# Altium schematic sheet Driver.SchDoc
size 1249 x 800 mm; SheetNumber: 1; SheetTotal: 1
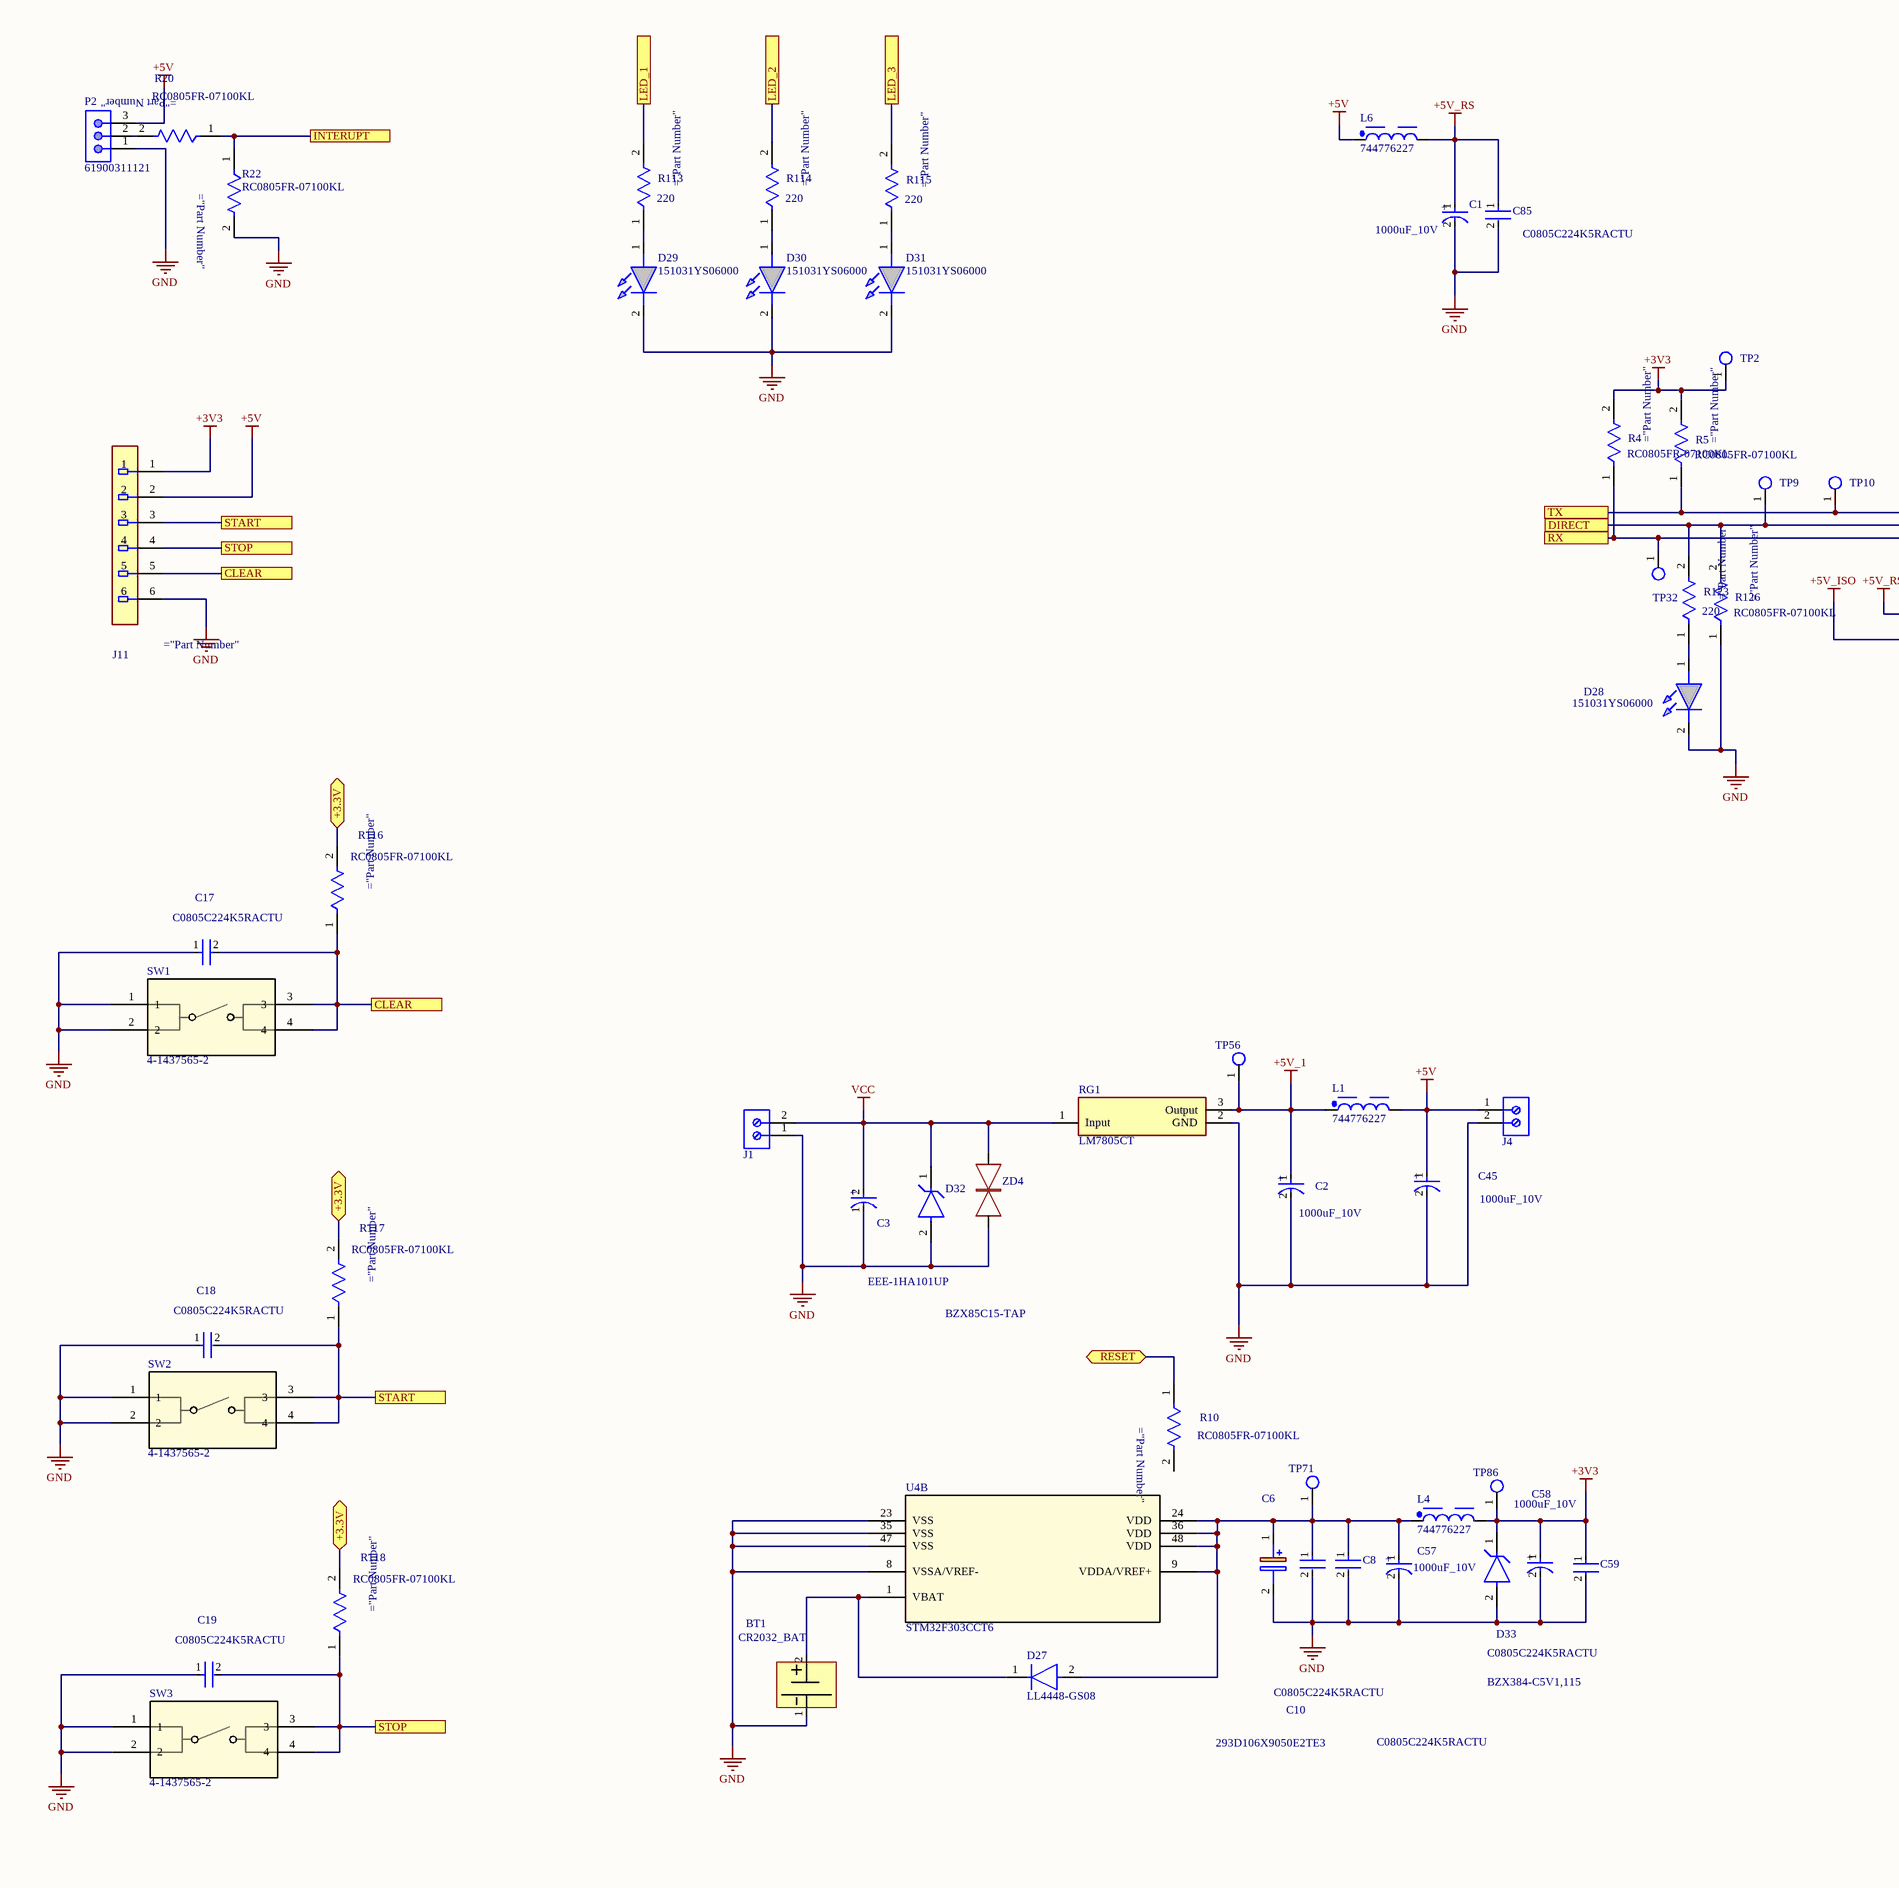
[diagram p0: Driver.SchDoc, top column 1 of 4]
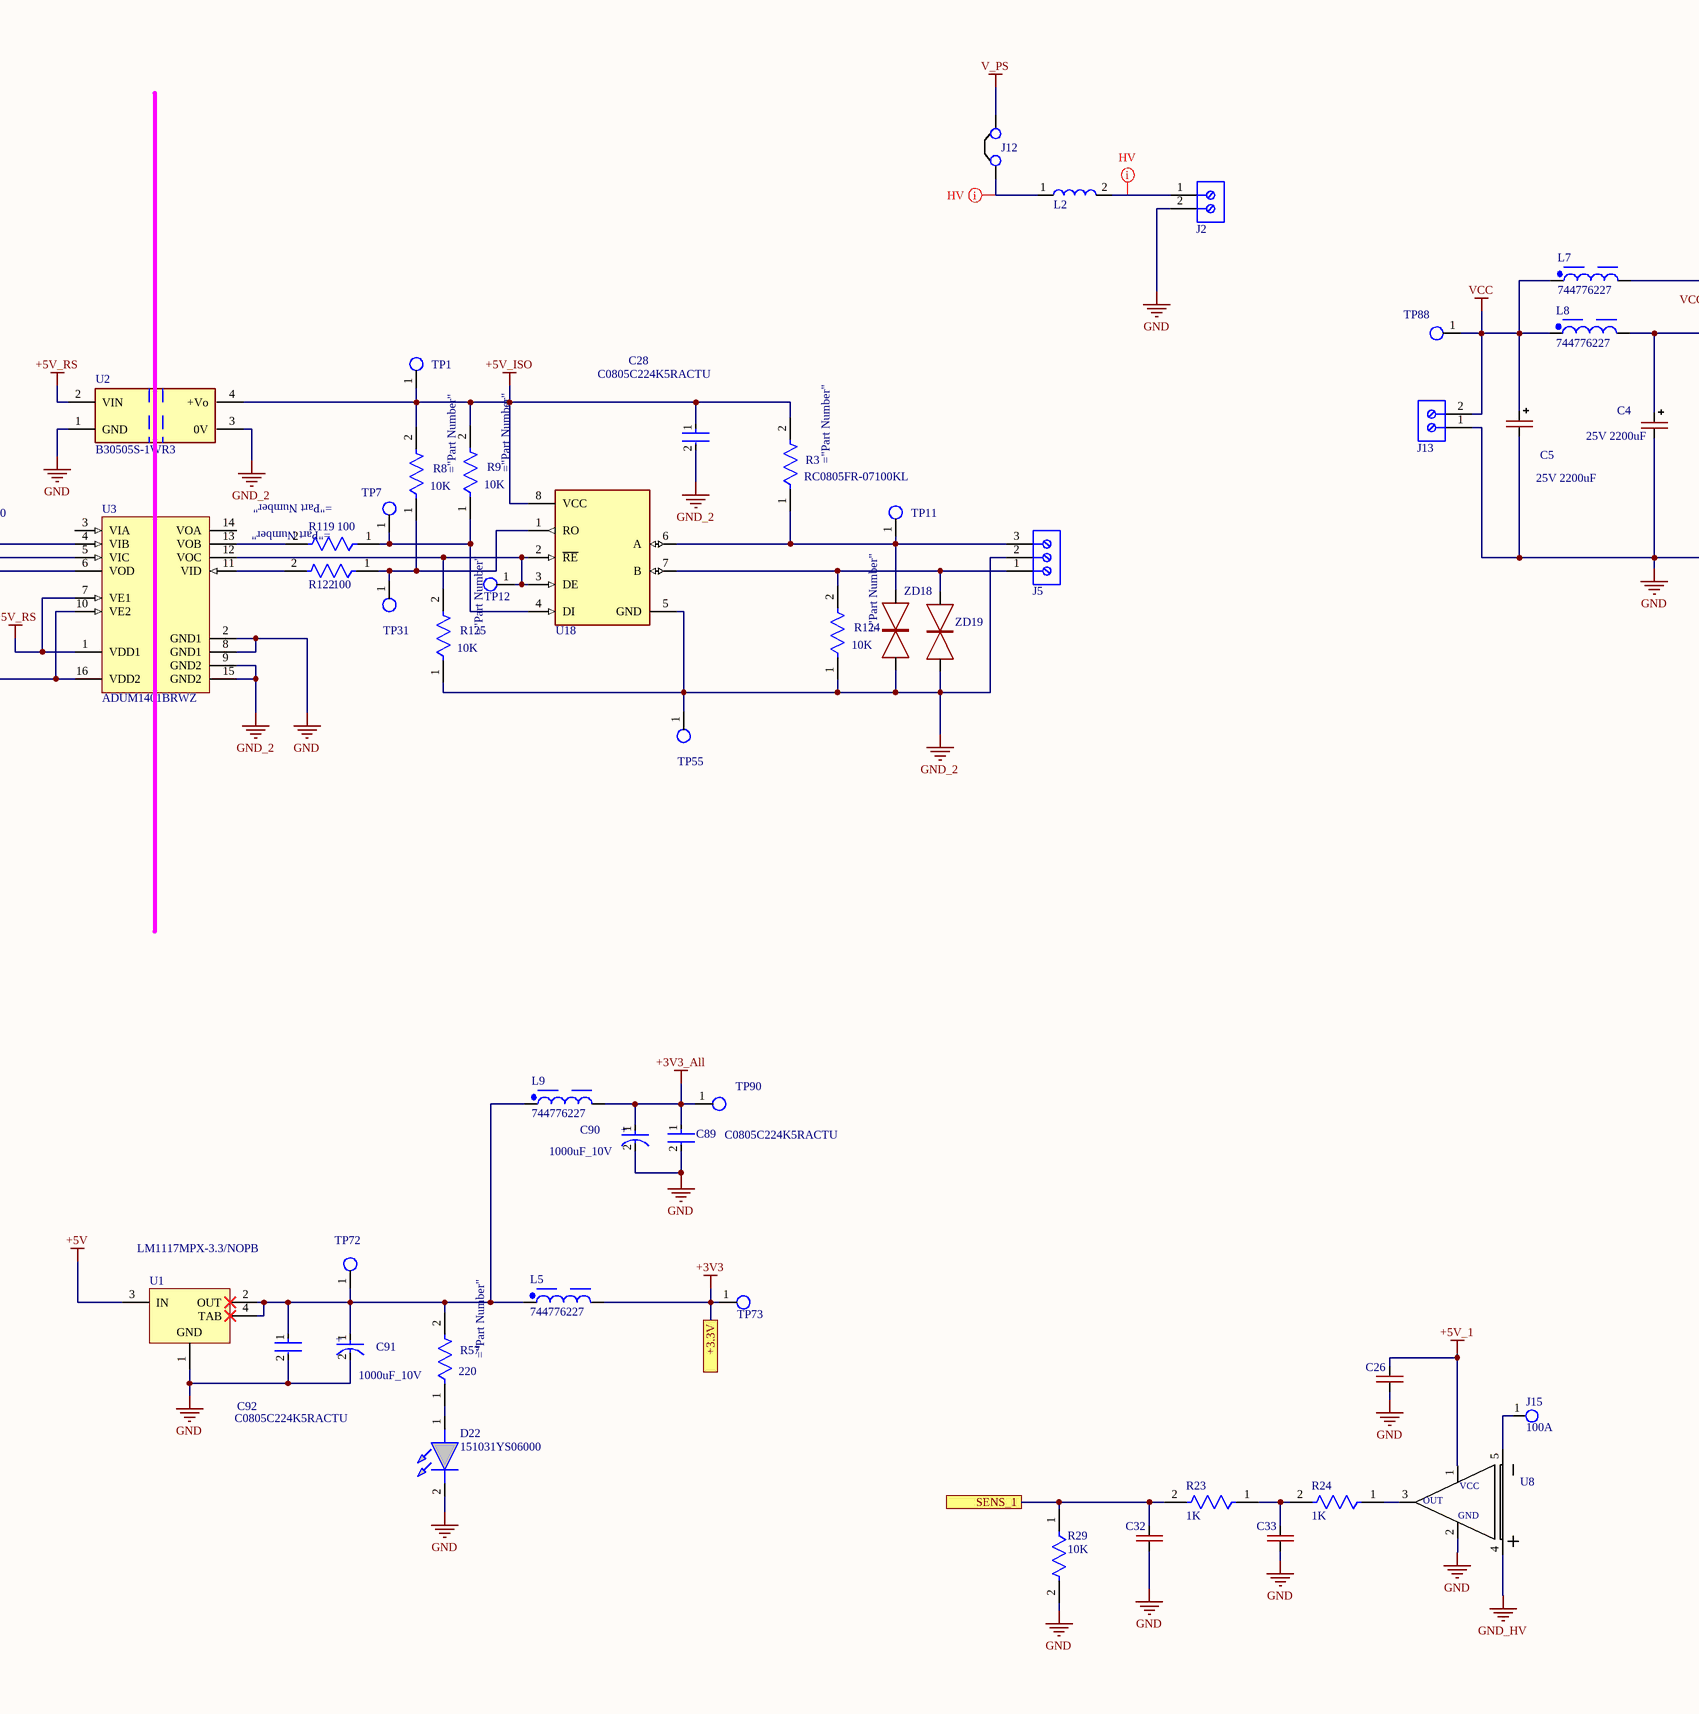
[diagram p1: Driver.SchDoc, top column 2 of 4]
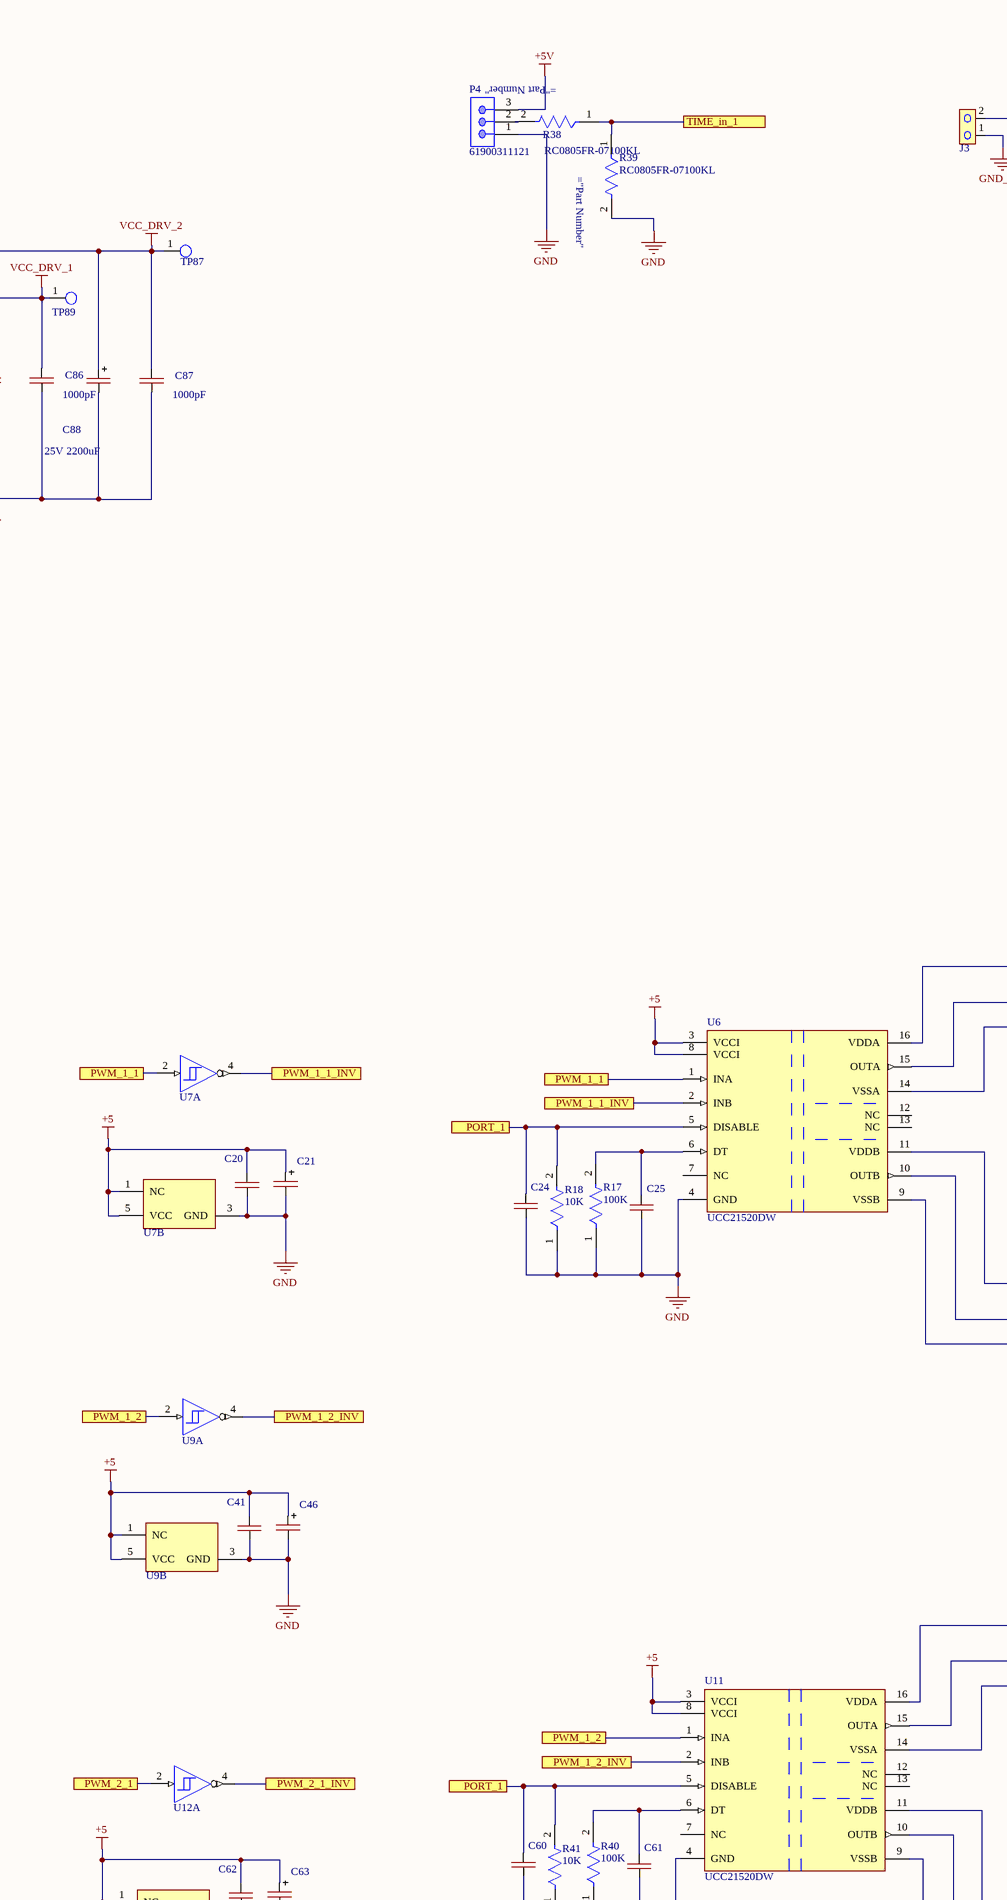
[diagram p2: Driver.SchDoc, top column 3 of 4]
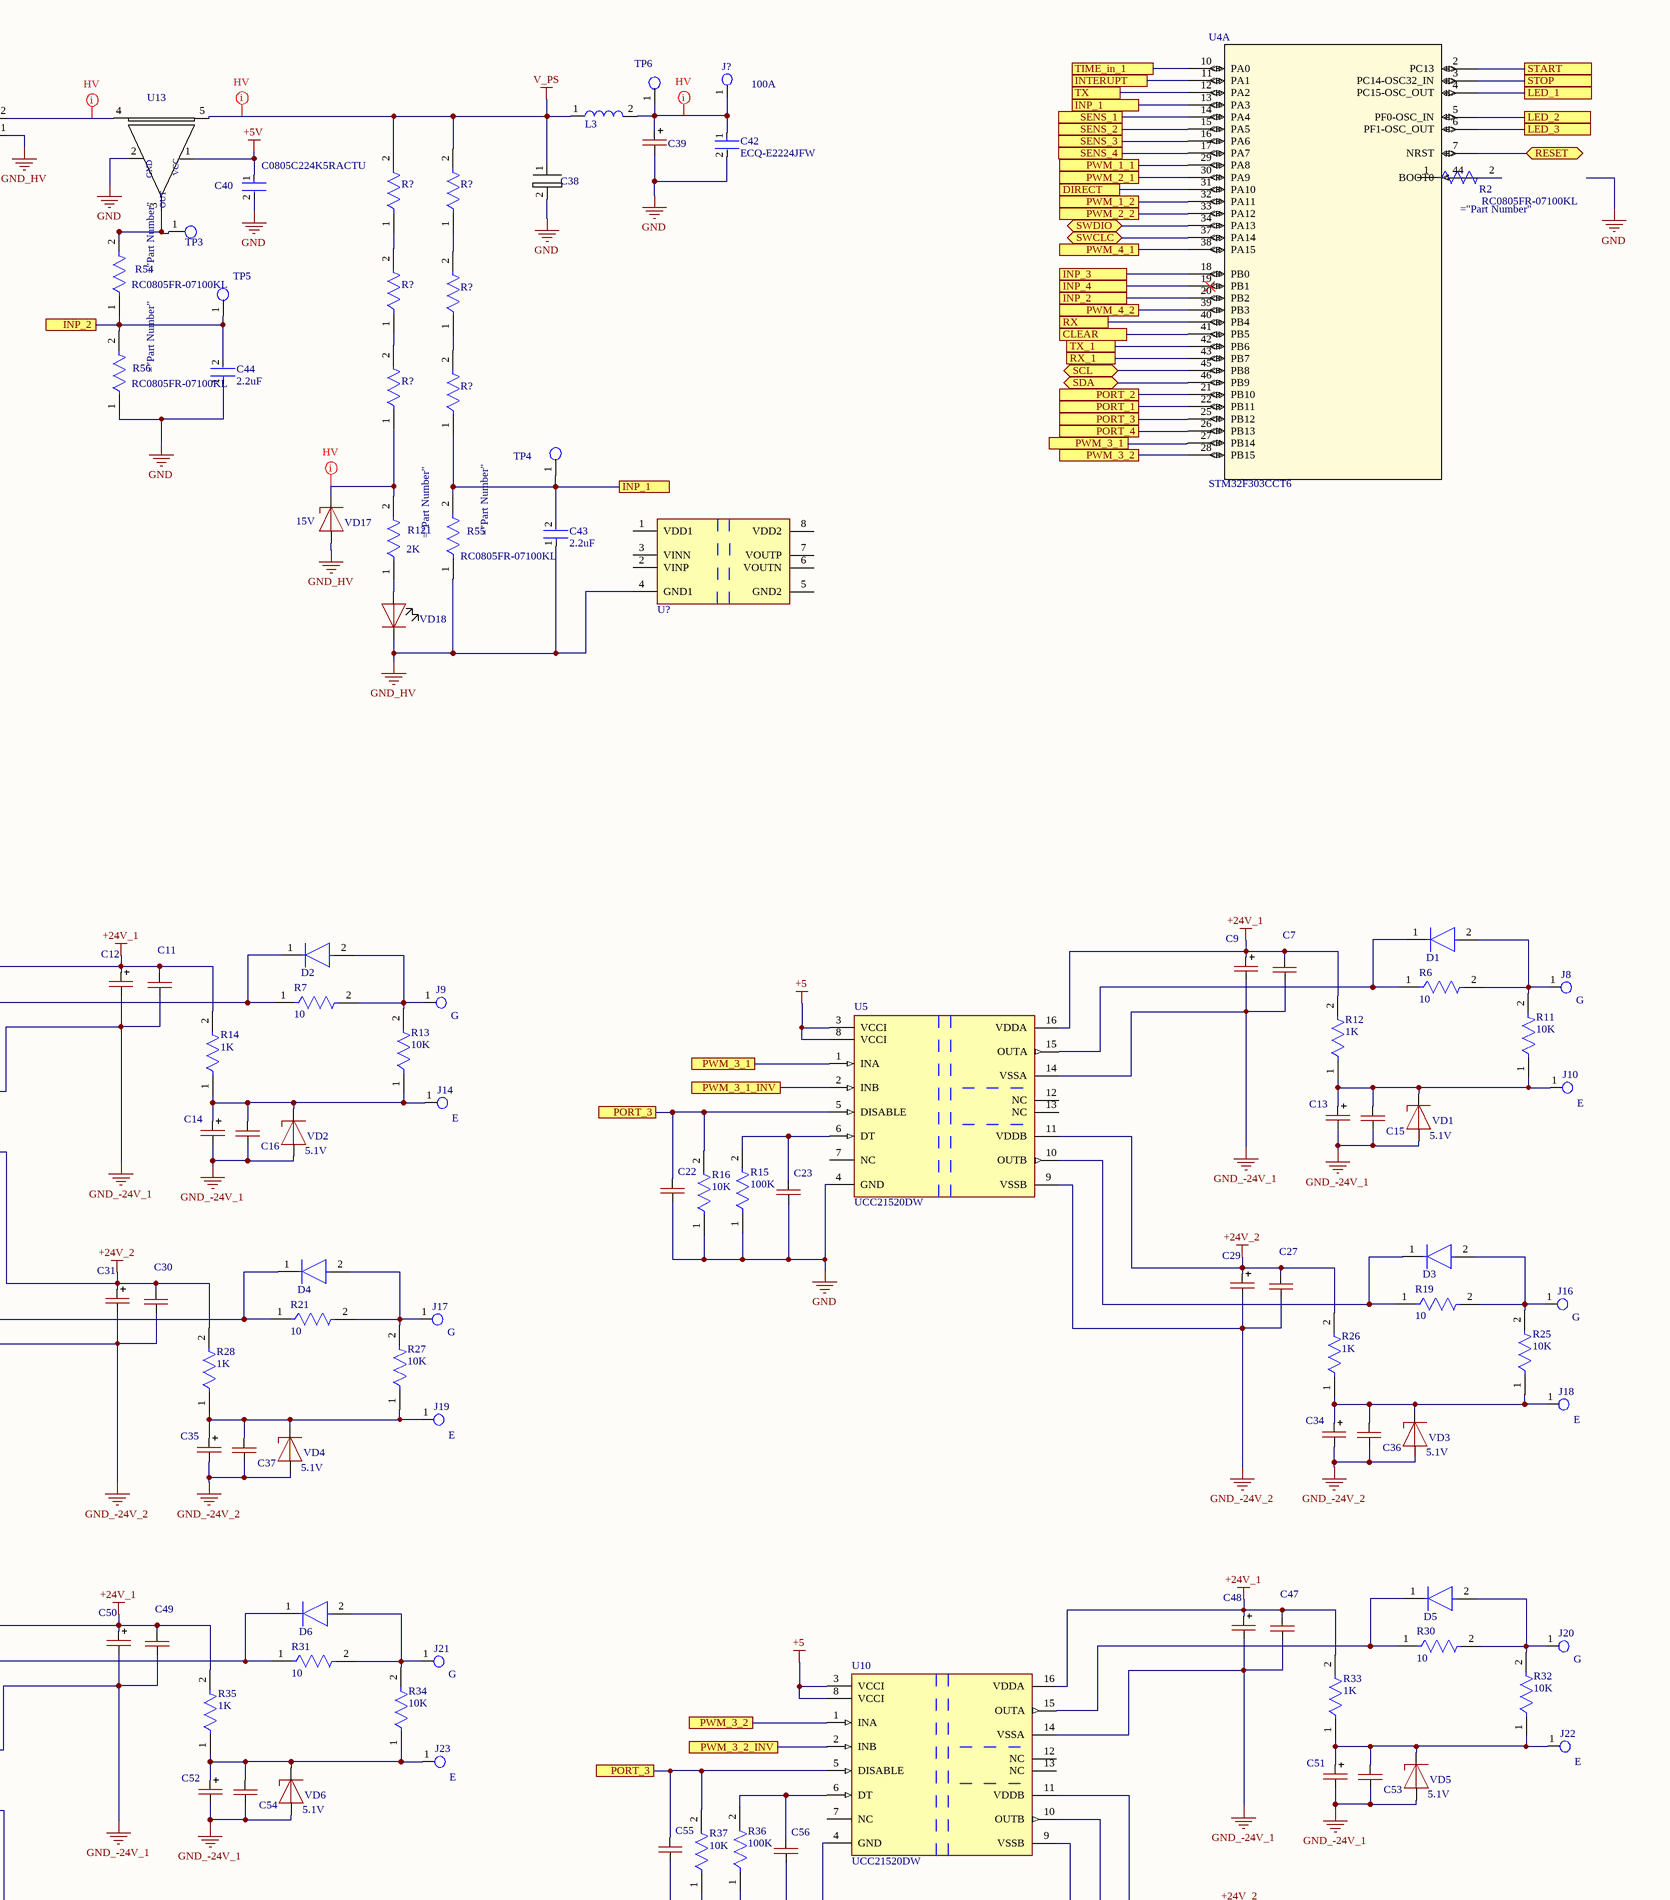
[diagram p3: Driver.SchDoc, top column 4 of 4]
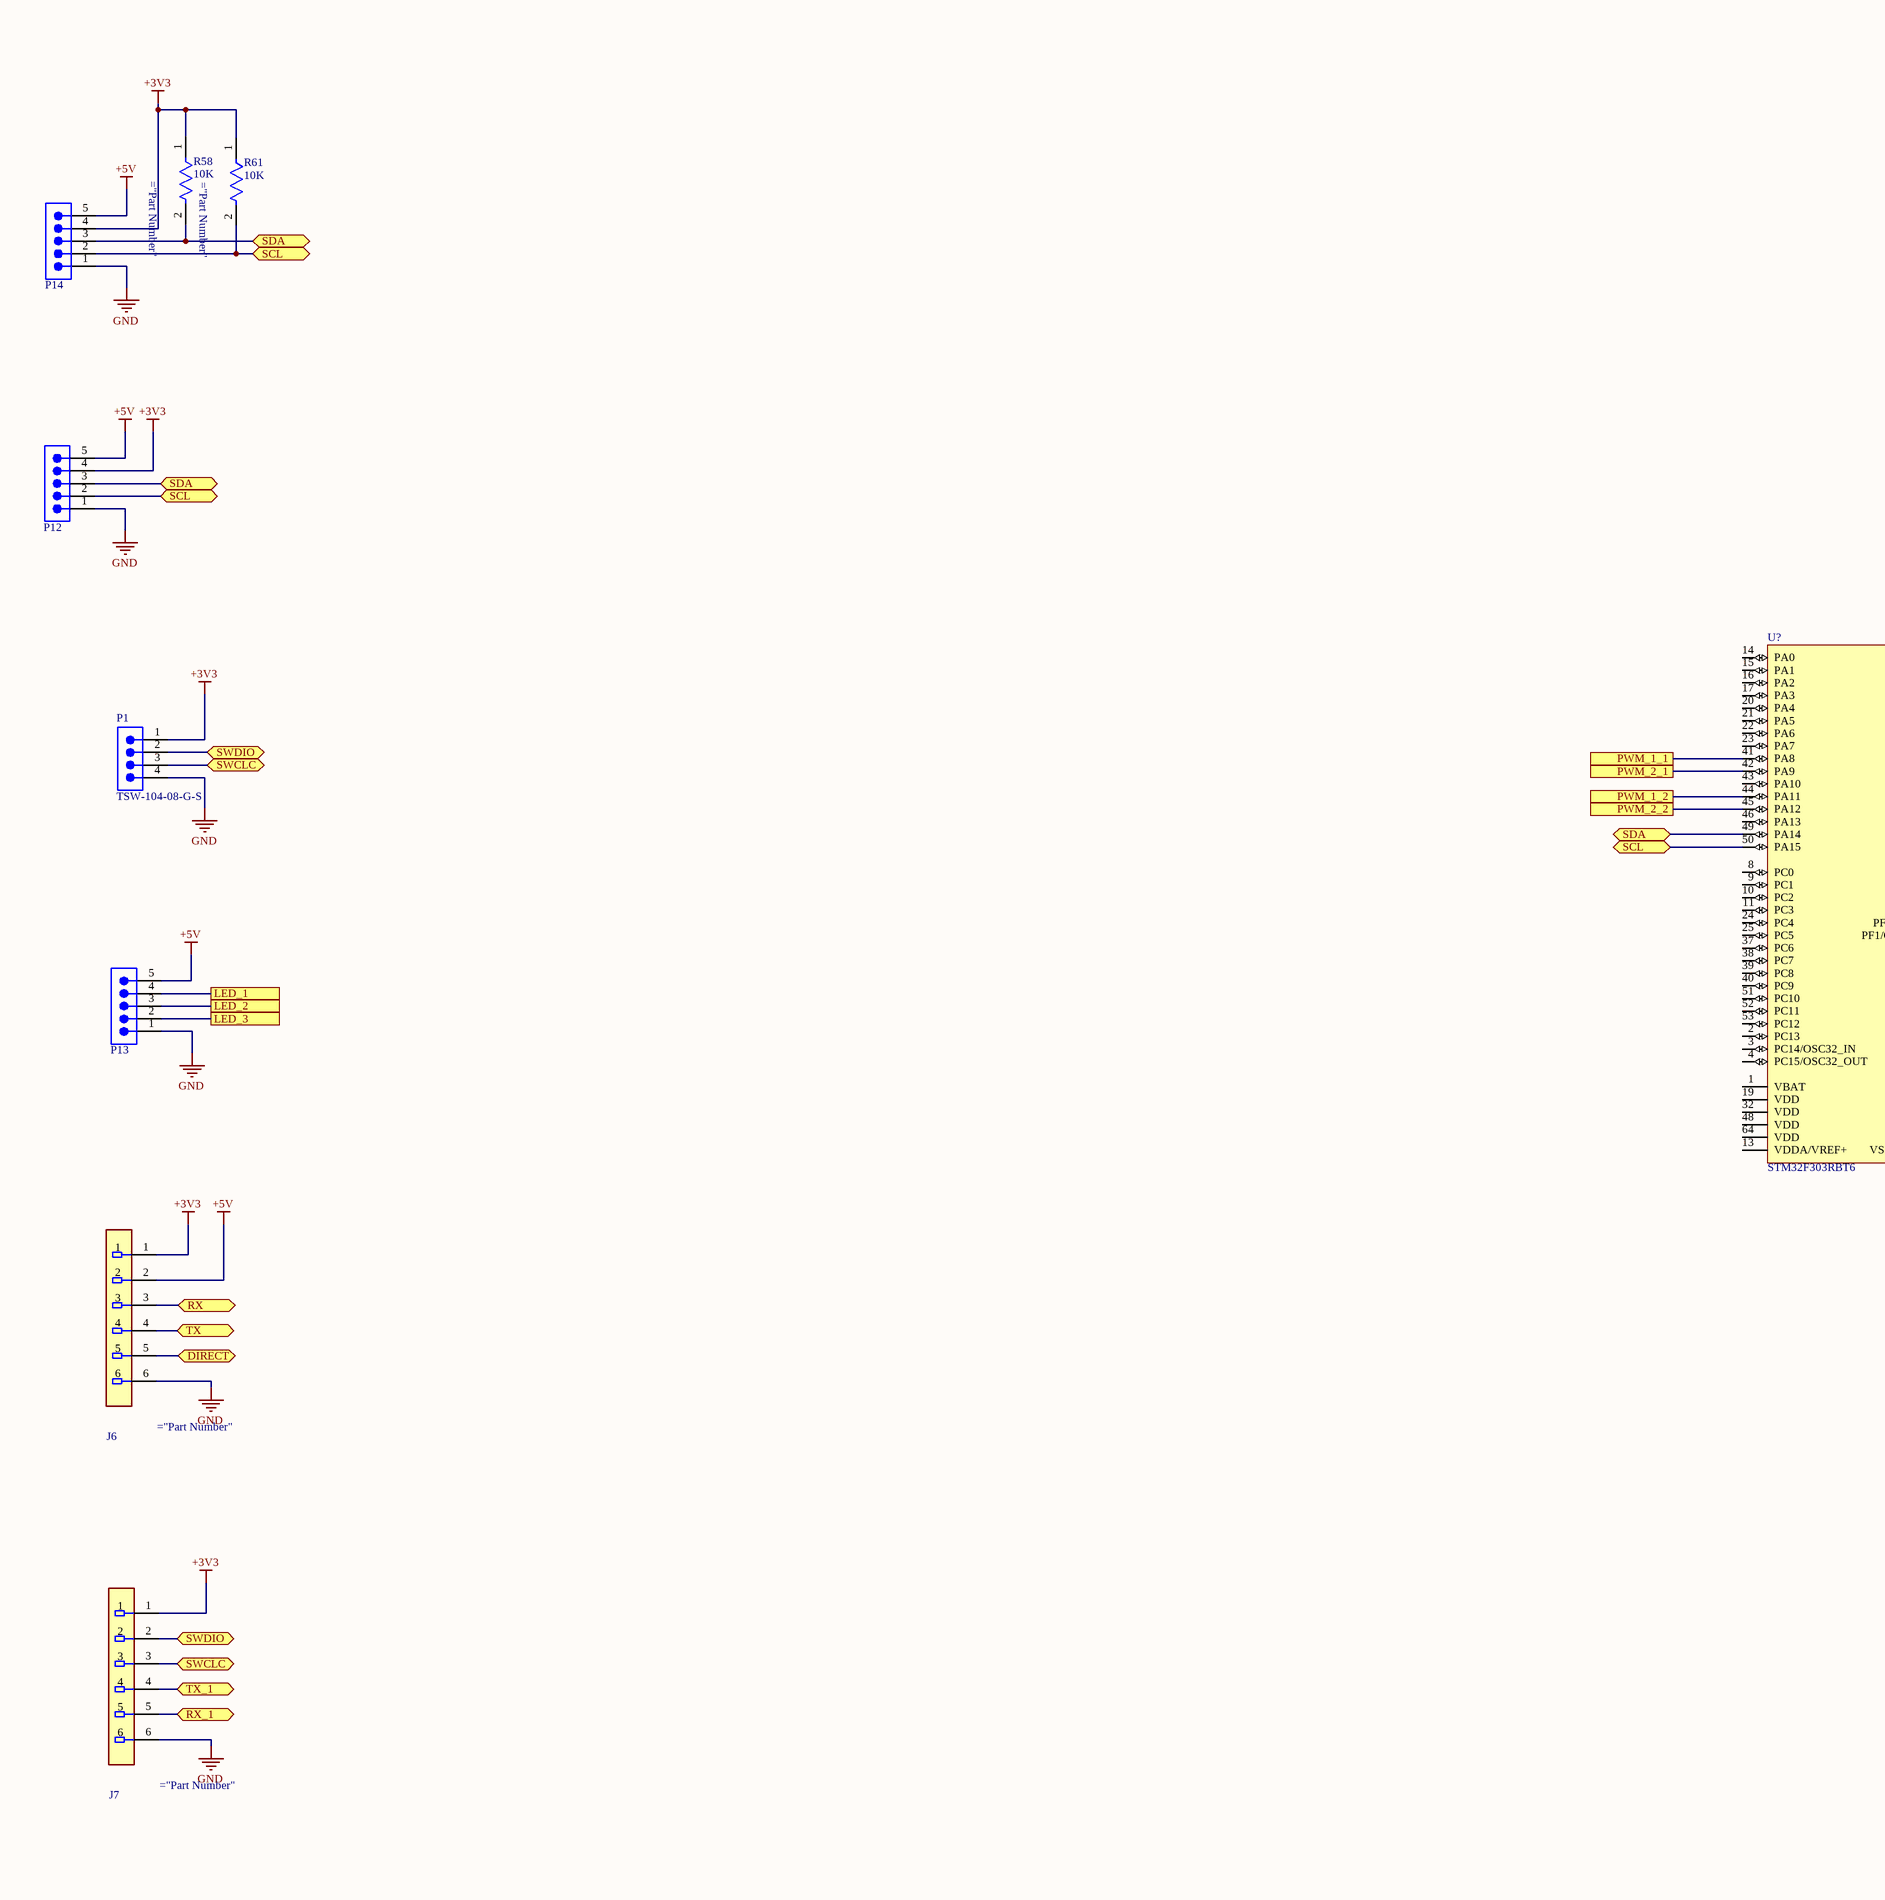
[diagram p4: Driver.SchDoc, bottom column 1 of 4]
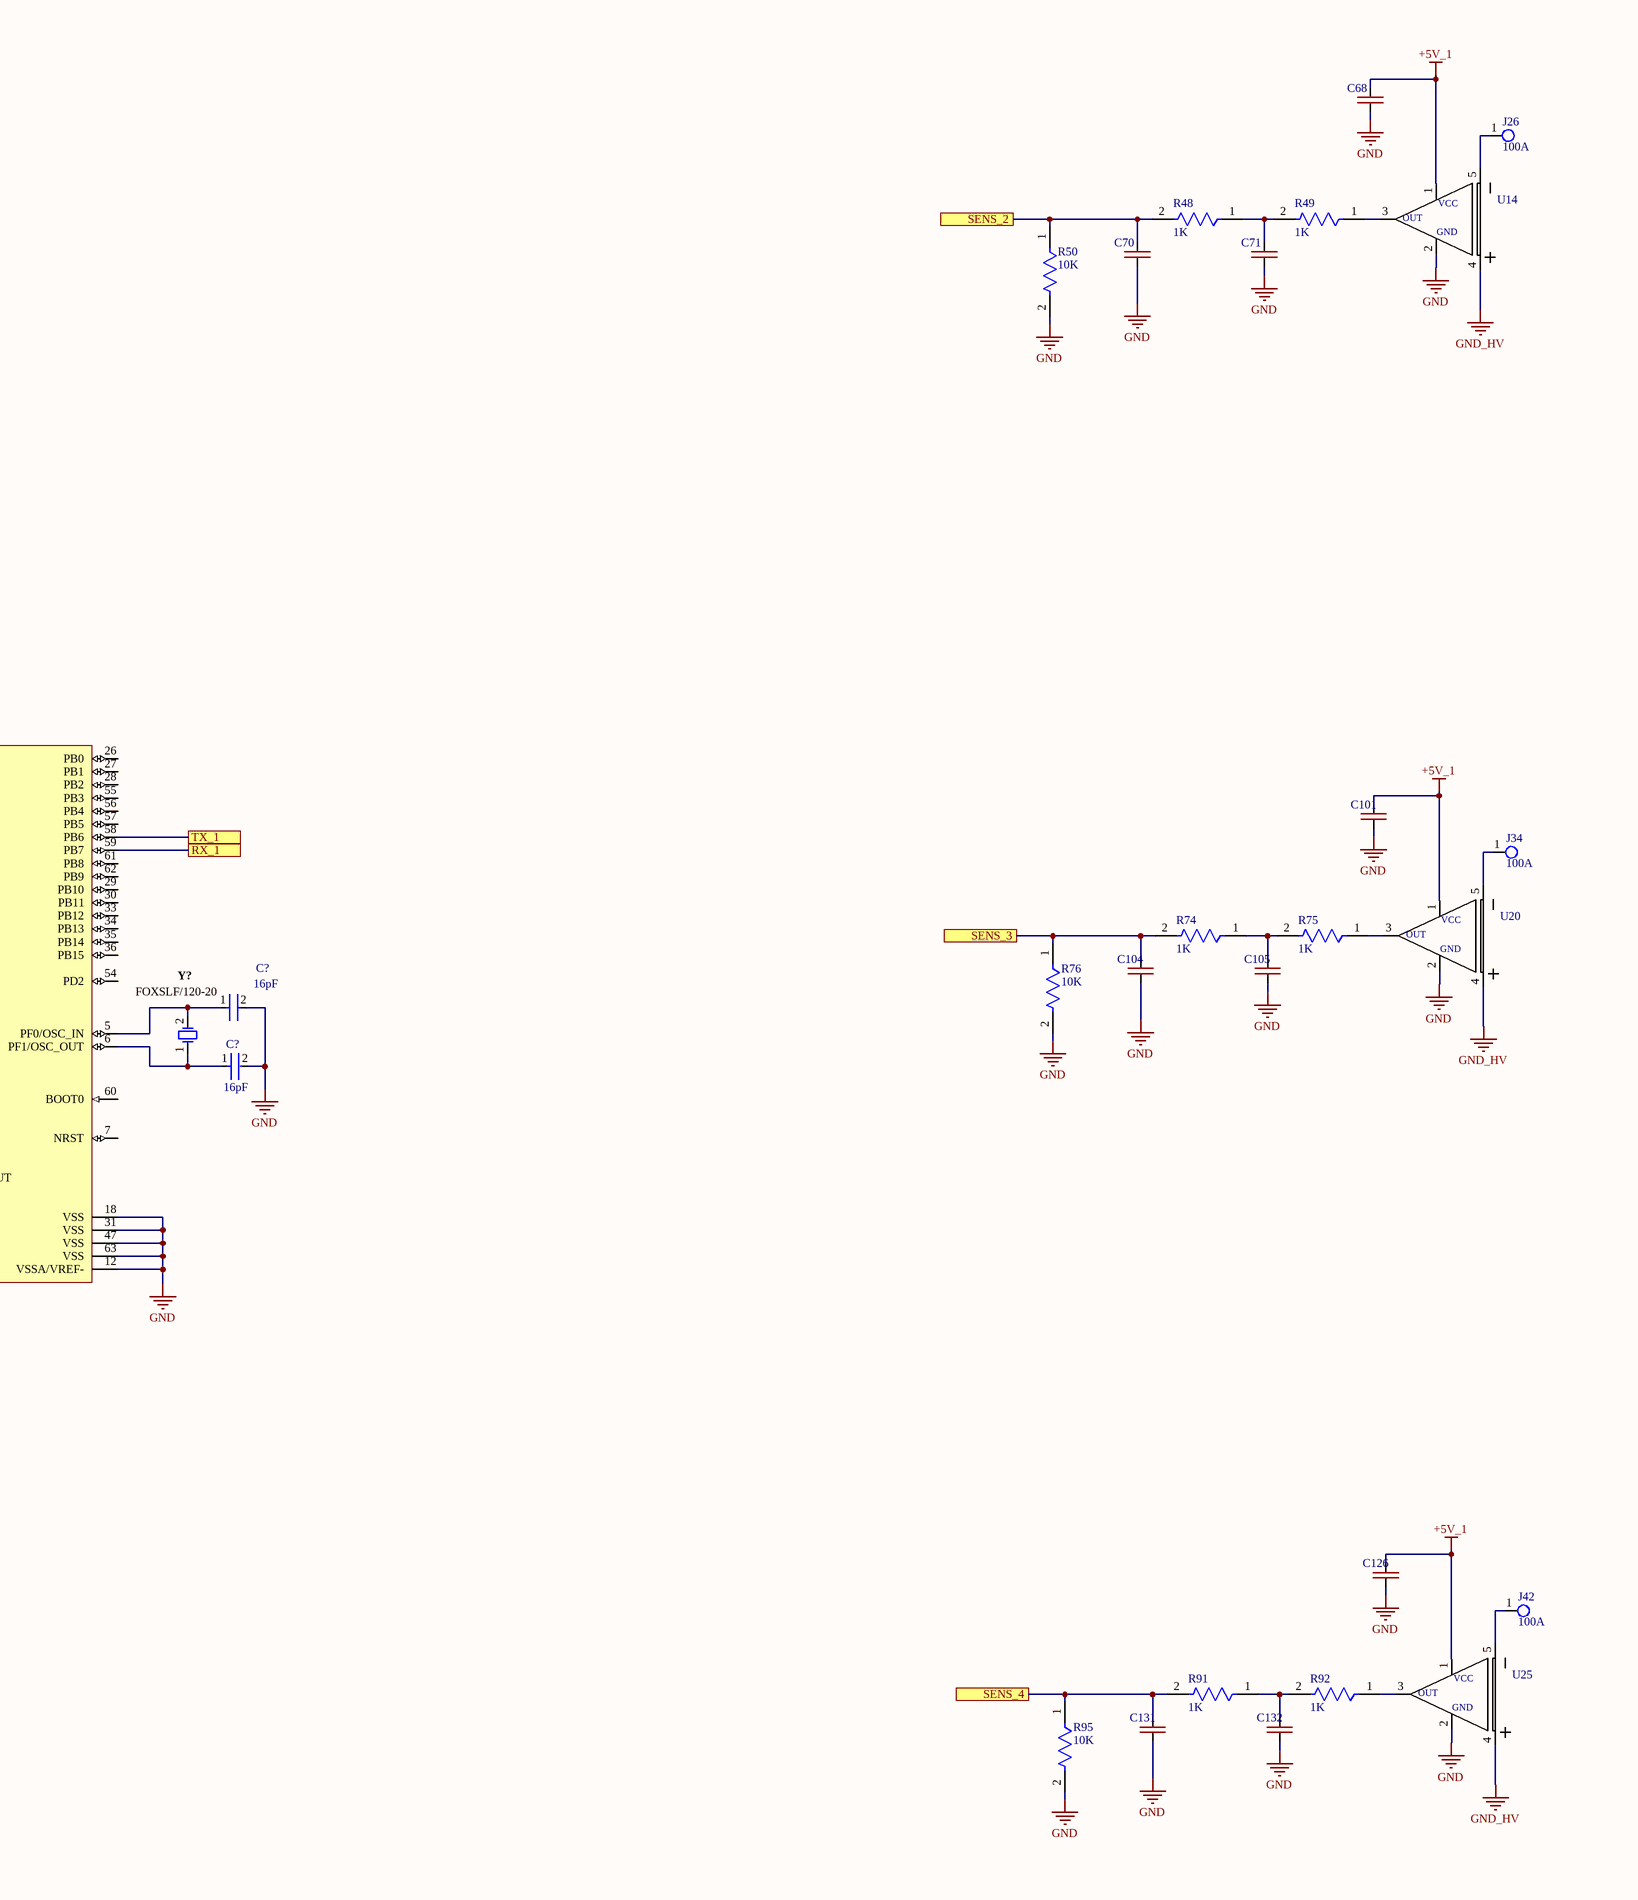
[diagram p5: Driver.SchDoc, bottom column 2 of 4]
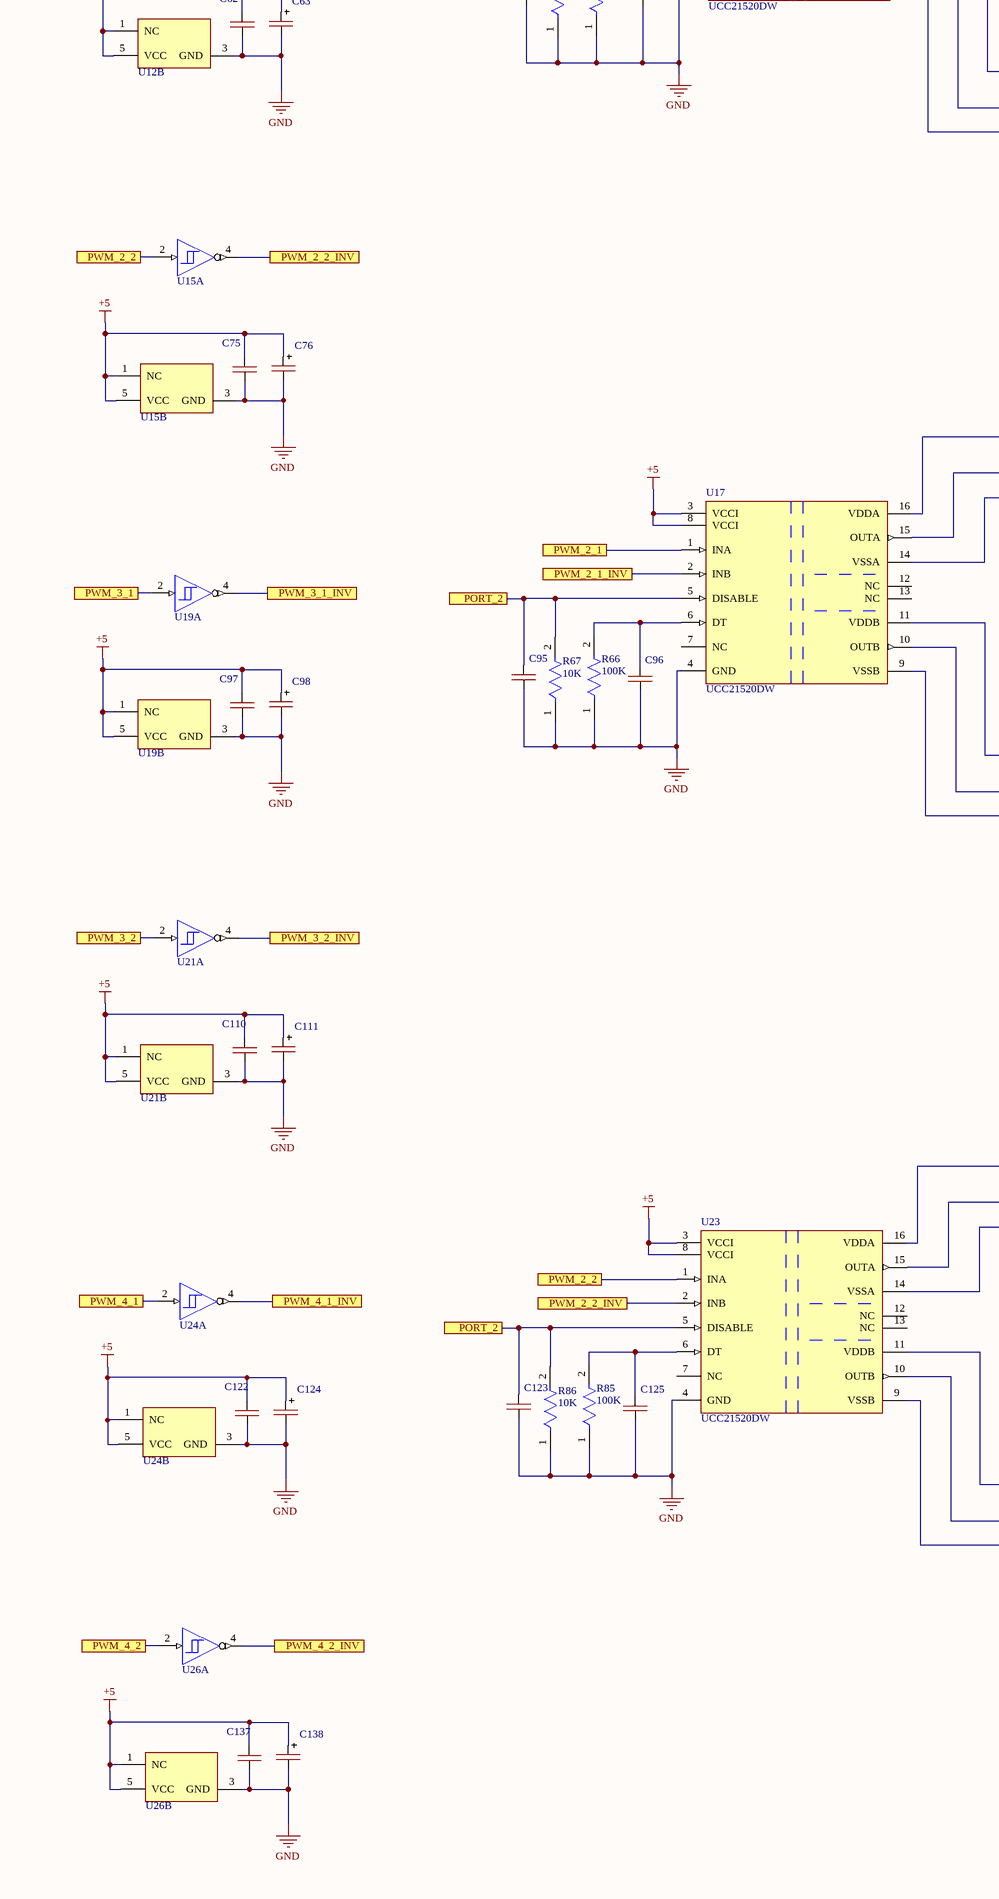
[diagram p6: Driver.SchDoc, bottom column 3 of 4]
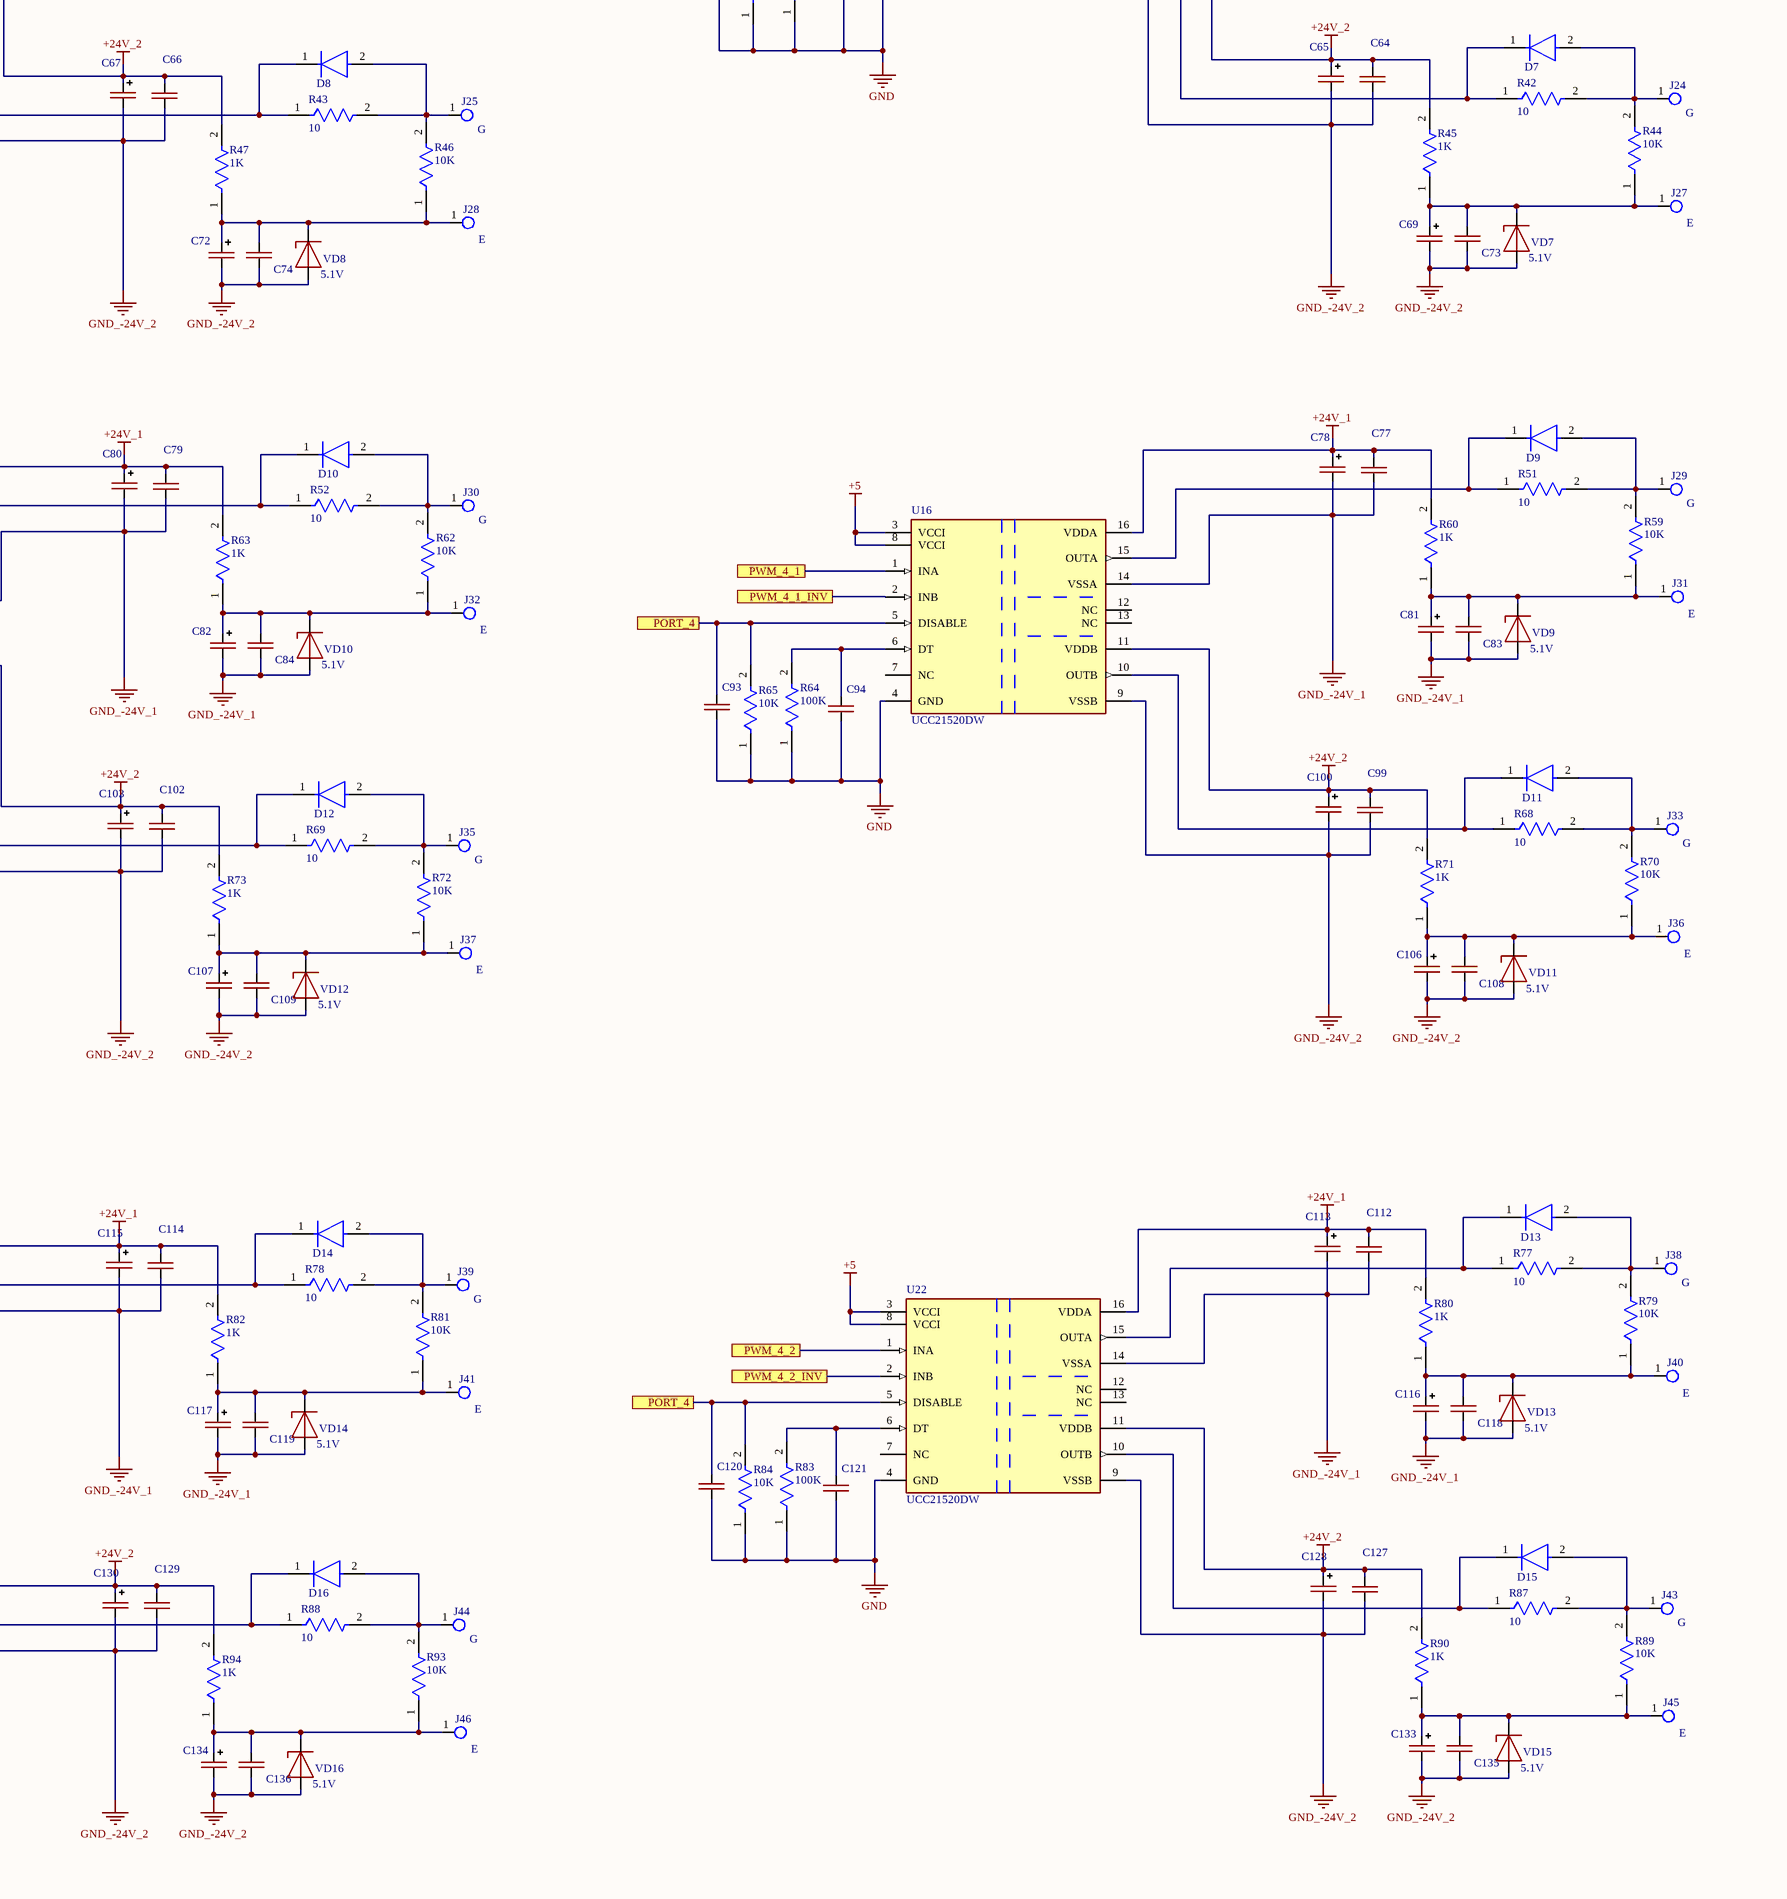
[diagram p7: Driver.SchDoc, bottom column 4 of 4]

## Parts
(Parts that share a designator on the sheet are numbered #1, #2 ... from top to bottom, then left to right.)
BT1  CR2032_BAT  [CR2032_BAT]
C1  1000uF_10V  [1000uF_10V_Size_F]
C2  1000uF_10V  [1000uF_10V_Size_F]
C3  EEE-1HA101UP  [FP-SF-MFG]
C4  25V 2200uF  [CAPPOL-12x25]
C5  25V 2200uF  [CAPPOL-12x25]
C6  293D106X9050E2TE3  [CAPPM7343X430N]
C7  CAP-NON-POLAR  [CAP-0805]  (value not drawn)
C8  C0805C224K5RACTU  [FP-C0805C-DN-MFG]
C9  CAP-POLAR  [CAPPOL-16x25]  (value not drawn)
C10  C0805C224K5RACTU  [FP-C0805C-DN-MFG]
C11  CAP-NON-POLAR  [CAP-0805]  (value not drawn)
C12  CAP-POLAR  [CAPPOL-16x25]  (value not drawn)
C13  CAP-POLAR  [CAP-TAN-D]  (value not drawn)
C14  CAP-POLAR  [CAP-TAN-D]  (value not drawn)
C15  CAP-NON-POLAR  [CAP-0805]  (value not drawn)
C16  CAP-NON-POLAR  [CAP-0805]  (value not drawn)
C17  C0805C224K5RACTU  [FP-C0805C-DN-IPC_A]
C18  C0805C224K5RACTU  [FP-C0805C-DN-IPC_A]
C19  C0805C224K5RACTU  [FP-C0805C-DN-IPC_A]
C20  CAP-NON-POLAR  [CAP-0805]  (value not drawn)
C21  CAP-POLAR  [CAP-TAN-D]  (value not drawn)
C22  CAP-NON-POLAR  [CAP-0805]  (value not drawn)
C23  CAP-NON-POLAR  [CAP-0805]  (value not drawn)
C24  CAP-NON-POLAR  [CAP-0805]  (value not drawn)
C25  CAP-NON-POLAR  [CAP-0805]  (value not drawn)
C26  CAP-NON-POLAR  [CAP-0805]  (value not drawn)
C27  CAP-NON-POLAR  [CAP-0805]  (value not drawn)
C28  C0805C224K5RACTU  [FP-C0805C-DN-MFG]
C29  CAP-POLAR  [CAPPOL-16x25]  (value not drawn)
C30  CAP-NON-POLAR  [CAP-0805]  (value not drawn)
C31  CAP-POLAR  [CAPPOL-16x25]  (value not drawn)
C32  CAP-NON-POLAR  [CAP-0805]  (value not drawn)
C33  CAP-NON-POLAR  [CAP-0805]  (value not drawn)
C34  CAP-POLAR  [CAP-TAN-D]  (value not drawn)
C35  CAP-POLAR  [CAP-TAN-D]  (value not drawn)
C36  CAP-NON-POLAR  [CAP-0805]  (value not drawn)
C37  CAP-NON-POLAR  [CAP-0805]  (value not drawn)
C38  450V_330uF  [CAP_450V_470uF]  (value not drawn)
C39  CAP-POLAR  [4700uF_100V]  (value not drawn)
C40  C0805C224K5RACTU  [FP-C0805C-DN-MFG]
C41  CAP-NON-POLAR  [CAP-0805]  (value not drawn)
C42  ECQ-E2224JFW  [FP-ECQ-E2224JFW-MFG]
C43  2.2uF  [FP-C0805C-DN-MFG]
C44  2.2uF  [FP-C0805C-DN-MFG]
C45  1000uF_10V  [1000uF_10V_Size_F]
C46  CAP-POLAR  [CAP-TAN-D]  (value not drawn)
C47  CAP-NON-POLAR  [CAP-0805]  (value not drawn)
C48  CAP-POLAR  [CAPPOL-16x25]  (value not drawn)
C49  CAP-NON-POLAR  [CAP-0805]  (value not drawn)
C50  CAP-POLAR  [CAPPOL-16x25]  (value not drawn)
C51  CAP-POLAR  [CAP-TAN-D]  (value not drawn)
C52  CAP-POLAR  [CAP-TAN-D]  (value not drawn)
C53  CAP-NON-POLAR  [CAP-0805]  (value not drawn)
C54  CAP-NON-POLAR  [CAP-0805]  (value not drawn)
C55  CAP-NON-POLAR  [CAP-0805]  (value not drawn)
C56  CAP-NON-POLAR  [CAP-0805]  (value not drawn)
C57  1000uF_10V  [1000uF_10V_Size_F]
C58  1000uF_10V  [1000uF_10V_Size_F]
C59  C0805C224K5RACTU  [FP-C0805C-DN-MFG]
C60  CAP-NON-POLAR  [CAP-0805]  (value not drawn)
C61  CAP-NON-POLAR  [CAP-0805]  (value not drawn)
C62  CAP-NON-POLAR  [CAP-0805]  (value not drawn)
C63  CAP-POLAR  [CAP-TAN-D]  (value not drawn)
C64  CAP-NON-POLAR  [CAP-0805]  (value not drawn)
C65  CAP-POLAR  [CAPPOL-16x25]  (value not drawn)
C66  CAP-NON-POLAR  [CAP-0805]  (value not drawn)
C67  CAP-POLAR  [CAPPOL-16x25]  (value not drawn)
C68  CAP-NON-POLAR  [CAP-0805]  (value not drawn)
C69  CAP-POLAR  [CAP-TAN-D]  (value not drawn)
C70  CAP-NON-POLAR  [CAP-0805]  (value not drawn)
C71  CAP-NON-POLAR  [CAP-0805]  (value not drawn)
C72  CAP-POLAR  [CAP-TAN-D]  (value not drawn)
C73  CAP-NON-POLAR  [CAP-0805]  (value not drawn)
C74  CAP-NON-POLAR  [CAP-0805]  (value not drawn)
C75  CAP-NON-POLAR  [CAP-0805]  (value not drawn)
C76  CAP-POLAR  [CAP-TAN-D]  (value not drawn)
C77  CAP-NON-POLAR  [CAP-0805]  (value not drawn)
C78  CAP-POLAR  [CAPPOL-16x25]  (value not drawn)
C79  CAP-NON-POLAR  [CAP-0805]  (value not drawn)
C80  CAP-POLAR  [CAPPOL-16x25]  (value not drawn)
C81  CAP-POLAR  [CAP-TAN-D]  (value not drawn)
C82  CAP-POLAR  [CAP-TAN-D]  (value not drawn)
C83  CAP-NON-POLAR  [CAP-0805]  (value not drawn)
C84  CAP-NON-POLAR  [CAP-0805]  (value not drawn)
C85  C0805C224K5RACTU  [FP-C0805C-DN-MFG]
C86  1000pF  [CAP-1206]
C87  1000pF  [CAP-1206]
C88  25V 2200uF  [CAPPOL-12x25]
C89  C0805C224K5RACTU  [FP-C0805C-DN-MFG]
C90  1000uF_10V  [1000uF_10V_Size_F]
C91  1000uF_10V  [1000uF_10V_Size_F]
C92  C0805C224K5RACTU  [FP-C0805C-DN-MFG]
C93  CAP-NON-POLAR  [CAP-0805]  (value not drawn)
C94  CAP-NON-POLAR  [CAP-0805]  (value not drawn)
C95  CAP-NON-POLAR  [CAP-0805]  (value not drawn)
C96  CAP-NON-POLAR  [CAP-0805]  (value not drawn)
C97  CAP-NON-POLAR  [CAP-0805]  (value not drawn)
C98  CAP-POLAR  [CAP-TAN-D]  (value not drawn)
C99  CAP-NON-POLAR  [CAP-0805]  (value not drawn)
C100  CAP-POLAR  [CAPPOL-16x25]  (value not drawn)
C101  CAP-NON-POLAR  [CAP-0805]  (value not drawn)
C102  CAP-NON-POLAR  [CAP-0805]  (value not drawn)
C103  CAP-POLAR  [CAPPOL-16x25]  (value not drawn)
C104  CAP-NON-POLAR  [CAP-0805]  (value not drawn)
C105  CAP-NON-POLAR  [CAP-0805]  (value not drawn)
C106  CAP-POLAR  [CAP-TAN-D]  (value not drawn)
C107  CAP-POLAR  [CAP-TAN-D]  (value not drawn)
C108  CAP-NON-POLAR  [CAP-0805]  (value not drawn)
C109  CAP-NON-POLAR  [CAP-0805]  (value not drawn)
C110  CAP-NON-POLAR  [CAP-0805]  (value not drawn)
C111  CAP-POLAR  [CAP-TAN-D]  (value not drawn)
C112  CAP-NON-POLAR  [CAP-0805]  (value not drawn)
C113  CAP-POLAR  [CAPPOL-16x25]  (value not drawn)
C114  CAP-NON-POLAR  [CAP-0805]  (value not drawn)
C115  CAP-POLAR  [CAPPOL-16x25]  (value not drawn)
C116  CAP-POLAR  [CAP-TAN-D]  (value not drawn)
C117  CAP-POLAR  [CAP-TAN-D]  (value not drawn)
C118  CAP-NON-POLAR  [CAP-0805]  (value not drawn)
C119  CAP-NON-POLAR  [CAP-0805]  (value not drawn)
C120  CAP-NON-POLAR  [CAP-0805]  (value not drawn)
C121  CAP-NON-POLAR  [CAP-0805]  (value not drawn)
C122  CAP-NON-POLAR  [CAP-0805]  (value not drawn)
C123  CAP-NON-POLAR  [CAP-0805]  (value not drawn)
C124  CAP-POLAR  [CAP-TAN-D]  (value not drawn)
C125  CAP-NON-POLAR  [CAP-0805]  (value not drawn)
C126  CAP-NON-POLAR  [CAP-0805]  (value not drawn)
C127  CAP-NON-POLAR  [CAP-0805]  (value not drawn)
C128  CAP-POLAR  [CAPPOL-16x25]  (value not drawn)
C129  CAP-NON-POLAR  [CAP-0805]  (value not drawn)
C130  CAP-POLAR  [CAPPOL-16x25]  (value not drawn)
C131  CAP-NON-POLAR  [CAP-0805]  (value not drawn)
C132  CAP-NON-POLAR  [CAP-0805]  (value not drawn)
C133  CAP-POLAR  [CAP-TAN-D]  (value not drawn)
C134  CAP-POLAR  [CAP-TAN-D]  (value not drawn)
C135  CAP-NON-POLAR  [CAP-0805]  (value not drawn)
C136  CAP-NON-POLAR  [CAP-0805]  (value not drawn)
C137  CAP-NON-POLAR  [CAP-0805]  (value not drawn)
C138  CAP-POLAR  [CAP-TAN-D]  (value not drawn)
C?#1  16pF  [FP-GRM21B-0_1-IPC_C]
C?#2  16pF  [FP-GRM21B-0_1-IPC_C]
D1  US1G  [US1G_SMA]  (value not drawn)
D2  US1G  [US1G_SMA]  (value not drawn)
D3  US1G  [US1G_SMA]  (value not drawn)
D4  US1G  [US1G_SMA]  (value not drawn)
D5  US1G  [US1G_SMA]  (value not drawn)
D6  US1G  [US1G_SMA]  (value not drawn)
D7  US1G  [US1G_SMA]  (value not drawn)
D8  US1G  [US1G_SMA]  (value not drawn)
D9  US1G  [US1G_SMA]  (value not drawn)
D10  US1G  [US1G_SMA]  (value not drawn)
D11  US1G  [US1G_SMA]  (value not drawn)
D12  US1G  [US1G_SMA]  (value not drawn)
D13  US1G  [US1G_SMA]  (value not drawn)
D14  US1G  [US1G_SMA]  (value not drawn)
D15  US1G  [US1G_SMA]  (value not drawn)
D16  US1G  [US1G_SMA]  (value not drawn)
D22  151031YS06000  [LED_Yellow]
D27  LL4448-GS08  [FP-6_560-5005_01-4-MFG]
D28  151031YS06000  [LED_BLUE]
D29  151031YS06000  [Wurth_Electronics_0_MFG]
D30  151031YS06000  [LED_GREEN]
D31  151031YS06000  [LED_BLUE]
D32  BZX85C15-TAP  [FP-6_561-5001_02-4-MFG]
D33  BZX384-C5V1,115  [FP-SOD323-MFG]
J1  691101710002  [691101710002]  (value not drawn)
J2  691101710002  [691101710002]  (value not drawn)
J3  TL-800  [Conn_Tianli_T-800]  (value not drawn)
J4  691101710002  [691101710002]  (value not drawn)
J5  691101710003  [691101710003]  (value not drawn)
J6  SWR25X-NRTC-S06-ST-BA  [Sullins_SWR25X-NRTC-S06-ST-BA_MFG]  (value not drawn)
J7  SWR25X-NRTC-S06-ST-BA  [Sullins_SWR25X-NRTC-S06-ST-BA_MFG]  (value not drawn)
J8  G  [Klema_PCB_15A]
J9  G  [Klema_PCB_15A]
J10  E  [Klema_PCB_15A]
J11  SWR25X-NRTC-S06-ST-BA  [Sullins_SWR25X-NRTC-S06-ST-BA_MFG]  (value not drawn)
J12  Jumper 1x2.54  [Jumper_2.54]  (value not drawn)
J13  691101710002  [691101710002]  (value not drawn)
J14  E  [Klema_PCB_15A]
J15  100A  [Klema_100A]
J16  G  [Klema_PCB_15A]
J17  G  [Klema_PCB_15A]
J18  E  [Klema_PCB_15A]
J19  E  [Klema_PCB_15A]
J20  G  [Klema_PCB_15A]
J21  G  [Klema_PCB_15A]
J22  E  [Klema_PCB_15A]
J23  E  [Klema_PCB_15A]
J24  G  [Klema_PCB_15A]
J25  G  [Klema_PCB_15A]
J26  100A  [Klema_100A]
J27  E  [Klema_PCB_15A]
J28  E  [Klema_PCB_15A]
J29  G  [Klema_PCB_15A]
J30  G  [Klema_PCB_15A]
J31  E  [Klema_PCB_15A]
J32  E  [Klema_PCB_15A]
J33  G  [Klema_PCB_15A]
J34  100A  [Klema_100A]
J35  G  [Klema_PCB_15A]
J36  E  [Klema_PCB_15A]
J37  E  [Klema_PCB_15A]
J38  G  [Klema_PCB_15A]
J39  G  [Klema_PCB_15A]
J40  E  [Klema_PCB_15A]
J41  E  [Klema_PCB_15A]
J42  100A  [Klema_100A]
J43  G  [Klema_PCB_15A]
J44  G  [Klema_PCB_15A]
J45  E  [Klema_PCB_15A]
J46  E  [Klema_PCB_15A]
J?  100A  [Klema_100A]
L1  744776227  [WE-PD2_1054]
L2  Coil  [Coil_drosel]  (value not drawn)
L3  Coil  [Coil_drosel]  (value not drawn)
L4  744776227  [WE-PD2_1054]
L5  744776227  [WE-PD2_1054]
L6  744776227  [WE-PD2_1054]
L7  744776227  [WE-PD2_1054]
L8  744776227  [WE-PD2_1054]
L9  744776227  [WE-PD2_1054]
P1  TSW-104-08-G-S  [SMTC-TSW-104-08-X-S]
P2  61900311121  [61900311121]
P4  61900311121  [61900311121]
P12  61300511121  [61300511121]  (value not drawn)
P13  61300511121  [61300511121]  (value not drawn)
P14  61300511121  [61300511121]  (value not drawn)
R2  RC0805FR-07100KL  [Yageo_RC0805_IPC_A]
R3  RC0805FR-07100KL  [Yageo_RC0805_IPC_A]
R4  RC0805FR-07100KL  [Yageo_RC0805_IPC_A]
R5  RC0805FR-07100KL  [Yageo_RC0805_IPC_A]
R6  10  [RES-2512]
R7  10  [RES-2512]
R8  10K  [Yageo_RC0805_IPC_A]
R9  10K  [Yageo_RC0805_IPC_A]
R10  RC0805FR-07100KL  [Yageo_RC0805_IPC_A]
R11  10K  [RES-0805]
R12  1K  [RES-2512]
R13  10K  [RES-0805]
R14  1K  [RES-2512]
R15  100K  [RES-0805]
R16  10K  [RES-0805]
R17  100K  [RES-0805]
R18  10K  [RES-0805]
R19  10  [RES-2512]
R20  RC0805FR-07100KL  [Yageo_RC0805_IPC_A]
R21  10  [RES-2512]
R22  RC0805FR-07100KL  [Yageo_RC0805_IPC_A]
R23  1K  [RES-0805]
R24  1K  [RES-0805]
R25  10K  [RES-0805]
R26  1K  [RES-2512]
R27  10K  [RES-0805]
R28  1K  [RES-2512]
R29  10K  [RES-0805]
R30  10  [RES-2512]
R31  10  [RES-2512]
R32  10K  [RES-0805]
R33  1K  [RES-2512]
R34  10K  [RES-0805]
R35  1K  [RES-2512]
R36  100K  [RES-0805]
R37  10K  [RES-0805]
R38  RC0805FR-07100KL  [Yageo_RC0805_IPC_A]
R39  RC0805FR-07100KL  [Yageo_RC0805_IPC_A]
R40  100K  [RES-0805]
R41  10K  [RES-0805]
R42  10  [RES-2512]
R43  10  [RES-2512]
R44  10K  [RES-0805]
R45  1K  [RES-2512]
R46  10K  [RES-0805]
R47  1K  [RES-2512]
R48  1K  [RES-0805]
R49  1K  [RES-0805]
R50  10K  [RES-0805]
R51  10  [RES-2512]
R52  10  [RES-2512]
R54  RC0805FR-07100KL  [Yageo_RC0805_IPC_A]
R55  RC0805FR-07100KL  [Yageo_RC0805_IPC_A]
R56  RC0805FR-07100KL  [Yageo_RC0805_IPC_A]
R57  220  [Yageo_RC0805_IPC_A]
R58  10K  [Yageo_RC0805_IPC_C]
R59  10K  [RES-0805]
R60  1K  [RES-2512]
R61  10K  [Yageo_RC0805_IPC_C]
R62  10K  [RES-0805]
R63  1K  [RES-2512]
R64  100K  [RES-0805]
R65  10K  [RES-0805]
R66  100K  [RES-0805]
R67  10K  [RES-0805]
R68  10  [RES-2512]
R69  10  [RES-2512]
R70  10K  [RES-0805]
R71  1K  [RES-2512]
R72  10K  [RES-0805]
R73  1K  [RES-2512]
R74  1K  [RES-0805]
R75  1K  [RES-0805]
R76  10K  [RES-0805]
R77  10  [RES-2512]
R78  10  [RES-2512]
R79  10K  [RES-0805]
R80  1K  [RES-2512]
R81  10K  [RES-0805]
R82  1K  [RES-2512]
R83  100K  [RES-0805]
R84  10K  [RES-0805]
R85  100K  [RES-0805]
R86  10K  [RES-0805]
R87  10  [RES-2512]
R88  10  [RES-2512]
R89  10K  [RES-0805]
R90  1K  [RES-2512]
R91  1K  [RES-0805]
R92  1K  [RES-0805]
R93  10K  [RES-0805]
R94  1K  [RES-2512]
R95  10K  [RES-0805]
R113  220  [Yageo_RC0805_IPC_C]
R114  220  [Yageo_RC0805_IPC_A]
R115  220  [Yageo_RC0805_IPC_A]
R116  RC0805FR-07100KL  [Yageo_RC0805_IPC_A]
R117  RC0805FR-07100KL  [Yageo_RC0805_IPC_A]
R118  RC0805FR-07100KL  [Yageo_RC0805_IPC_A]
R119  100  [Yageo_RC0805_IPC_A]
R121  2K  [Yageo_RC0805_IPC_A]
R122  100  [Yageo_RC0805_IPC_A]
R123  220  [Yageo_RC0805_IPC_A]
R124  10K  [Yageo_RC0805_IPC_A]
R125  10K  [Yageo_RC0805_IPC_A]
R126  RC0805FR-07100KL  [Yageo_RC0805_IPC_A]
R?#1  RES_1210  [RES_SMD_1210_IPC_A]  (value not drawn)
R?#2  RES_1210  [RES_SMD_1210_IPC_A]  (value not drawn)
R?#3  RES_1210  [RES_SMD_1210_IPC_A]  (value not drawn)
R?#4  RES_1210  [RES_SMD_1210_IPC_A]  (value not drawn)
R?#5  RES_1210  [RES_SMD_1210_IPC_A]  (value not drawn)
R?#6  RES_1210  [RES_SMD_1210_IPC_A]  (value not drawn)
RG1  Part Number: LM7805CT  [TO-220(bend_rad)]  (hidden comment: Reg_Fairchild_LM7805CT_eec)
SW1  4-1437565-2  [SW4_FSM-5P23_TEC]
SW2  4-1437565-2  [SW4_FSM-5P23_TEC]
SW3  4-1437565-2  [SW4_FSM-5P23_TEC]
TP1  Test_Point_PCB  [Test_Point]  (value not drawn)
TP2  Test_Point_PCB  [Test_Point]  (value not drawn)
TP3  Test_Point_PCB  [Test_Point]  (value not drawn)
TP4  Test_Point_PCB  [Test_Point]  (value not drawn)
TP5  Test_Point_PCB  [Test_Point]  (value not drawn)
TP6  Test_Point_PCB  [Test_Point]  (value not drawn)
TP7  Test_Point_PCB  [Test_Point]  (value not drawn)
TP9  Test_Point_PCB  [Test_Point]  (value not drawn)
TP10  Test_Point_PCB  [Test_Point]  (value not drawn)
TP11  Test_Point_PCB  [Test_Point]  (value not drawn)
TP12  Test_Point_PCB  [Test_Point]  (value not drawn)
TP31  Test_Point_PCB  [Test_Point]  (value not drawn)
TP32  Test_Point_PCB  [Test_Point]  (value not drawn)
TP55  Test_Point_PCB  [Test_Point]  (value not drawn)
TP56  Test_Point_PCB  [Test_Point]  (value not drawn)
TP71  Test_Point_PCB  [Test_Point]  (value not drawn)
TP72  Test_Point_PCB  [Test_Point]  (value not drawn)
TP73  Test_Point_PCB  [Test_Point]  (value not drawn)
TP86  Test_Point_PCB  [Test_Point]  (value not drawn)
TP87  Test_Point_PCB  [Test_Point]  (value not drawn)
TP88  Test_Point_PCB  [Test_Point]  (value not drawn)
TP89  Test_Point_PCB  [Test_Point]  (value not drawn)
TP90  Test_Point_PCB  [Test_Point]  (value not drawn)
U1  LM1117MPX-3.3/NOPB  [DCY0004A_L]
U2  B30505S-1WR3  [FP-B0505S-1WR3-MFG]
U3  ADUM1401BRWZ  [ADI-RW-16_M]
U4  STM32F303CCT6  [LQFP48-7x7mm]  (parts A,B of 2)
U5  UCC21520DW  [FP-DW0016B-MFG]
U6  UCC21520DW  [FP-DW0016B-MFG]
U7  74LVC1G14  [SOT23-5_N]  (value not drawn)  (parts A,B of 2)
U8  ACS758  [ACS758-100]  (value not drawn)
U9  74LVC1G14  [SOT23-5_N]  (value not drawn)  (parts A,B of 2)
U10  UCC21520DW  [FP-DW0016B-MFG]
U11  UCC21520DW  [FP-DW0016B-MFG]
U12  74LVC1G14  [SOT23-5_N]  (value not drawn)  (parts A,B of 2)
U13  (no value)  [ACS758-100]
U14  ACS758  [ACS758-100]  (value not drawn)
U15  74LVC1G14  [SOT23-5_N]  (value not drawn)  (parts A,B of 2)
U16  UCC21520DW  [FP-DW0016B-MFG]
U17  UCC21520DW  [FP-DW0016B-MFG]
U18  MAX485ECSA+  [SOIC127P600X175-8N]  (value not drawn)
U19  74LVC1G14  [SOT23-5_N]  (value not drawn)  (parts A,B of 2)
U20  ACS758  [ACS758-100]  (value not drawn)
U21  74LVC1G14  [SOT23-5_N]  (value not drawn)  (parts A,B of 2)
U22  UCC21520DW  [FP-DW0016B-MFG]
U23  UCC21520DW  [FP-DW0016B-MFG]
U24  74LVC1G14  [SOT23-5_N]  (value not drawn)  (parts A,B of 2)
U25  ACS758  [ACS758-100]  (value not drawn)
U26  74LVC1G14  [SOT23-5_N]  (value not drawn)  (parts A,B of 2)
U?#1  AMC1301  [FP-DWV0008A-MFG]  (value not drawn)
U?#2  STM32F303RBT6  [LQFP64-10x10mm]
VD1  5.1V  [DO-35]
VD2  5.1V  [DO-35]
VD3  5.1V  [DO-35]
VD4  5.1V  [DO-35]
VD5  5.1V  [DO-35]
VD6  5.1V  [DO-35]
VD7  5.1V  [DO-35]
VD8  5.1V  [DO-35]
VD9  5.1V  [DO-35]
VD10  5.1V  [DO-35]
VD11  5.1V  [DO-35]
VD12  5.1V  [DO-35]
VD13  5.1V  [DO-35]
VD14  5.1V  [DO-35]
VD15  5.1V  [DO-35]
VD16  5.1V  [DO-35]
VD17  15V  [DO-017AA]
VD18  LED  [LED-0603]  (value not drawn)
Y?  FOXSLF/120-20  [FOX-FOXSLF-2_V]
ZD4  P6SMB16CA  [DO-214AA]  (value not drawn)
ZD18  P6SMB16CA  [DO-214AA]  (value not drawn)
ZD19  P6SMB16CA  [DO-214AA]  (value not drawn)

## Ports
+3.3V, +3.3V (bidir), CLEAR, DIRECT, DIRECT (bidir), INP_1, INP_2, INP_3, INP_4, INTERUPT, LED_1, LED_2, LED_3, PORT_1, PORT_2, PORT_3, PORT_4, PWM_1_1, PWM_1_1_INV, PWM_1_2, PWM_1_2_INV, PWM_2_1, PWM_2_1_INV, PWM_2_2, PWM_2_2_INV, PWM_3_1, PWM_3_1_INV, PWM_3_2, PWM_3_2_INV, PWM_4_1, PWM_4_1_INV, PWM_4_2, PWM_4_2_INV, RESET (bidir), RX, RX (bidir), RX_1, RX_1 (bidir), SCL (bidir), SDA (bidir), SENS_1, SENS_2, SENS_3, SENS_4, START, STOP, SWCLC (bidir), SWDIO (bidir), TIME_in_1, TX, TX (bidir), TX_1, TX_1 (bidir)

## Nets
+3V3: C58.1(+) C59.1 D33.1(C) J6.1 J7.1 J11.1 L4.2 L5.2 P1.1 P12.4 P14.4 R4.2 R5.2 R58.1 R61.1 R116.2 R117.2 R118.2 TP2.1(G9) TP73.1(G9) TP86.1(G9) ; port +3.3V
+3V3_All: C89.1 C90.1(+) L9.2 TP90.1(G9)
+5: C20.2 C21.1(+) C41.2 C46.1(+) C62.2 C63.1(+) C75.2 C76.1(+) C97.2 C98.1(+) C110.2 C111.1(+) C122.2 C124.1(+) C137.2 C138.1(+) U5.3(VCCI) U5.8(VCCI) U6.3(VCCI) U6.8(VCCI) U7.1(NC) U7.5(VCC) U9.1(NC) U9.5(VCC) U10.3(VCCI) U10.8(VCCI) U11.3(VCCI) U11.8(VCCI) U12.1(NC) U12.5(VCC) U15.1(NC) U15.5(VCC) U16.3(VCCI) U16.8(VCCI) U17.3(VCCI) U17.8(VCCI) U19.1(NC) U19.5(VCC) U21.1(NC) U21.5(VCC) U22.3(VCCI) U22.8(VCCI) U23.3(VCCI) U23.8(VCCI) U24.1(NC) U24.5(VCC) U26.1(NC) U26.5(VCC)
+5V: C40.1 C45.1(+) J4.1 J6.2 J11.2 L1.2 L6.1 P2.3 P4.3 P12.5 P13.5 P14.5 U1.3(IN) U13.1(+VCC)
+5V_1: C2.1(+) C26.2 C68.2 C101.2 C126.2 L1.1 RG1.3(Output) TP56.1(G9) U8.1(+VCC) U14.1(+VCC) U20.1(+VCC) U25.1(+VCC)
+5V_ISO: C28.1 R3.2 R8.2 R9.2 TP1.1(G9) U2.4(+Vo) U3.10(VE2) U3.16(VDD2) U18.8(VCC)
+5V_RS: C1.1(+) C85.1 L6.2 U2.2(VIN) U3.1(VDD1) U3.7(VE1)
+24V_1: C7.2 C9.1(+) C11.2 C12.1(+) C47.2 C48.1(+) C49.2 C50.1(+) C77.2 C78.1(+) C79.2 C80.1(+) C112.2 C113.1(+) C114.2 C115.1(+) R12.2 R14.2 R33.2 R35.2 R60.2 R63.2 R80.2 R82.2 U5.16(VDDA) U6.16(VDDA) U10.16(VDDA) U11.16(VDDA) U16.16(VDDA) U17.16(VDDA) U22.16(VDDA) U23.16(VDDA)
+24V_2: C27.2 C29.1(+) C30.2 C31.1(+) C64.2 C65.1(+) C66.2 C67.1(+) C99.2 C100.1(+) C102.2 C103.1(+) C127.2 C128.1(+) C129.2 C130.1(+) R26.2 R28.2 R45.2 R47.2 R71.2 R73.2 R90.2 R94.2 U5.11(VDDB) U6.11(VDDB) U10.11(VDDB) U11.11(VDDB) U16.11(VDDB) U17.11(VDDB) U22.11(VDDB) U23.11(VDDB)
GND: BT1.1(-) C1.2(-) C2.2(-) C3.1(C) C4.2(-) C5.2(-) C6.2(-) C8.2 C10.2 C17.1 C18.1 C19.1 C20.1 C21.2(-) C22.1 C23.1 C24.1 C25.1 C26.1 C32.1 C33.1 C38.2 C39.2(-) C40.2 C41.1 C42.2 C44.1 C45.2(-) C46.2(-) C55.1 C56.1 C57.2(-) C58.2(-) C59.2 C60.1 C61.1 C62.1 C63.2(-) C68.1 C70.1 C71.1 C75.1 C76.2(-) C85.2 C86.1 C87.1 C88.2(-) C89.2 C90.2(-) C91.2(-) C92.2 C93.1 C94.1 C95.1 C96.1 C97.1 C98.2(-) C101.1 C104.1 C105.1 C110.1 C111.2(-) C120.1 C121.1 C122.1 C123.1 C124.2(-) C125.1 C126.1 C131.1 C132.1 C137.1 C138.2(-) C?#1.2 C?#2.2 D22.2(K) D28.2(K) D29.2(K) D30.2(K) D31.2(K) D32.2(A) D33.2(A) J1.1 J2.2 J4.2 J6.6 J7.6 J11.6 J13.1 P1.4 P2.1 P4.1 P12.1 P13.1 P14.1 R15.1 R16.1 R17.1 R18.1 R22.2 R29.2 R36.1 R37.1 R39.2 R40.1 R41.1 R50.2 R56.1 R64.1 R65.1 R66.1 R67.1 R76.2 R83.1 R84.1 R85.1 R86.1 R95.2 R126.1 RG1.2(GND) SW1.1 SW1.2 SW2.1 SW2.2 SW3.1 SW3.2 U1.1(GND) U2.1(GND) U3.2(GND1) U3.8(GND1) U4.8(VSSA/VREF-) U4.23(VSS) U4.35(VSS) U4.47(VSS) U5.4(GND) U6.4(GND) U7.3(GND) U8.2(GND) U9.3(GND) U10.4(GND) U11.4(GND) U12.3(GND) U13.2(GND) U14.2(GND) U15.3(GND) U16.4(GND) U17.4(GND) U19.3(GND) U20.2(GND) U21.3(GND) U22.4(GND) U23.4(GND) U24.3(GND) U25.2(GND) U26.3(GND) U?#2.12(VSSA/VREF-) U?#2.18(VSS) U?#2.31(VSS) U?#2.47(VSS) U?#2.63(VSS) ZD4.1(A)
GND_2: C28.2 J5.2 R124.1 R125.1 TP55.1(G9) U2.3(0V) U3.9(GND2) U3.15(GND2) U18.5(GND) ZD18.1(A) ZD19.1(A)
GND_-24V_1: C7.1 C9.2(-) C11.1 C12.2(-) C13.2(-) C14.2(-) C15.1 C16.1 C47.1 C48.2(-) C49.1 C50.2(-) C51.2(-) C52.2(-) C53.1 C54.1 C77.1 C78.2(-) C79.1 C80.2(-) C81.2(-) C82.2(-) C83.1 C84.1 C112.1 C113.2(-) C114.1 C115.2(-) C116.2(-) C117.2(-) C118.1 C119.1 U5.14(VSSA) U6.14(VSSA) U10.14(VSSA) U11.14(VSSA) U16.14(VSSA) U17.14(VSSA) U22.14(VSSA) U23.14(VSSA) VD1.2(A) VD2.2(A) VD5.2(A) VD6.2(A) VD9.2(A) VD10.2(A) VD13.2(A) VD14.2(A)
GND_-24V_2: C27.1 C29.2(-) C30.1 C31.2(-) C34.2(-) C35.2(-) C36.1 C37.1 C64.1 C65.2(-) C66.1 C67.2(-) C69.2(-) C72.2(-) C73.1 C74.1 C99.1 C100.2(-) C102.1 C103.2(-) C106.2(-) C107.2(-) C108.1 C109.1 C127.1 C128.2(-) C129.1 C130.2(-) C133.2(-) C134.2(-) C135.1 C136.1 U5.9(VSSB) U6.9(VSSB) U10.9(VSSB) U11.9(VSSB) U16.9(VSSB) U17.9(VSSB) U22.9(VSSB) U23.9(VSSB) VD3.2(A) VD4.2(A) VD7.2(A) VD8.2(A) VD11.2(A) VD12.2(A) VD15.2(A) VD16.2(A)
GND_HV: C43.1 J3.1 R55.1 U8.4(+IP) U14.4(+IP) U20.4(+IP) U25.4(+IP) U?#1.4(GND1) VD17.2(A) VD18.1(C)
V_PS: C38.1 J12.2 L3.1 R?#1.2 R?#2.2 U13.5(-IP)
VCC: C3.2(A) C5.1(+) D32.1(C) J1.2 J13.2 L7.1 L8.1 RG1.1(Input) TP88.1(G9) ZD4.2(A)
VCC_DRV_1: C4.1(+) C86.2 L8.2 TP89.1(G9)
VCC_DRV_2: C87.2 C88.1(+) L7.2 TP87.1(G9)
CLEAR: C17.2 J11.5 R116.1 SW1.3 SW1.4 U4.41(PB5) ; port CLEAR
DIRECT: J6.5 R123.2 R126.2 TP9.1(G9) U3.5(VIC) U4.31(PA10) ; port DIRECT
INP_1: C43.2 R55.2 R?#6.1 TP4.1(G9) U4.13(PA3) ; port INP_1
INP_2: C44.2 R54.1 R56.2 TP5.1(G9) U4.20(PB2) ; port INP_2
INP_3: U4.18(PB0) ; port INP_3
INP_4: U4.19(PB1) ; port INP_4
INTERUPT: R20.1 R22.1 U4.11(PA1) ; port INTERUPT
LED_1: P13.4 R113.2 U4.4(PC15-OSC_OUT) ; port LED_1
LED_2: P13.3 R114.2 U4.5(PF0-OSC_IN) ; port LED_2
LED_3: P13.2 R115.2 U4.6(PF1-OSC_OUT) ; port LED_3
PORT_1: C24.2 C60.2 R18.2 R41.2 U4.22(PB11) U6.5(DISABLE) U11.5(DISABLE) ; port PORT_1
PORT_2: C95.2 C123.2 R67.2 R86.2 U4.21(PB10) U17.5(DISABLE) U23.5(DISABLE) ; port PORT_2
PORT_3: C22.2 C55.2 R16.2 R37.2 U4.25(PB12) U5.5(DISABLE) U10.5(DISABLE) ; port PORT_3
PORT_4: C93.2 C120.2 R65.2 R84.2 U4.26(PB13) U16.5(DISABLE) U22.5(DISABLE) ; port PORT_4
PWM_1_1: U4.29(PA8) U6.1(INA) U7.2(A) U?#2.41(PA8) ; port PWM_1_1
PWM_1_1_INV: U6.2(INB) U7.4(Y) ; port PWM_1_1_INV
PWM_1_2: U4.32(PA11) U9.2(A) U11.1(INA) U?#2.44(PA11) ; port PWM_1_2
PWM_1_2_INV: U9.4(Y) U11.2(INB) ; port PWM_1_2_INV
PWM_2_1: U4.30(PA9) U12.2(A) U17.1(INA) U?#2.42(PA9) ; port PWM_2_1
PWM_2_1_INV: U12.4(Y) U17.2(INB) ; port PWM_2_1_INV
PWM_2_2: U4.33(PA12) U15.2(A) U23.1(INA) U?#2.45(PA12) ; port PWM_2_2
PWM_2_2_INV: U15.4(Y) U23.2(INB) ; port PWM_2_2_INV
PWM_3_1: U4.27(PB14) U5.1(INA) U19.2(A) ; port PWM_3_1
PWM_3_1_INV: U5.2(INB) U19.4(Y) ; port PWM_3_1_INV
PWM_3_2: U4.28(PB15) U10.1(INA) U21.2(A) ; port PWM_3_2
PWM_3_2_INV: U10.2(INB) U21.4(Y) ; port PWM_3_2_INV
PWM_4_1: U4.38(PA15) U16.1(INA) U24.2(A) ; port PWM_4_1
PWM_4_1_INV: U16.2(INB) U24.4(Y) ; port PWM_4_1_INV
PWM_4_2: U4.39(PB3) U22.1(INA) U26.2(A) ; port PWM_4_2
PWM_4_2_INV: U22.2(INB) U26.4(Y) ; port PWM_4_2_INV
RESET: R10.1 U4.7(NRST) ; port RESET
RX: J6.3 R4.1 TP32.1(G9) U3.6(VOD) U4.40(PB4) ; port RX
RX_1: J7.5 U4.43(PB7) U?#2.59(PB7) ; port RX_1
SCL: P12.2 P14.2 R61.2 U4.45(PB8) U?#2.50(PA15) ; port SCL
SDA: P12.3 P14.3 R58.2 U4.46(PB9) U?#2.49(PA14) ; port SDA
SENS_1: C32.2 R23.2 R29.1 U4.14(PA4) ; port SENS_1
SENS_2: C70.2 R48.2 R50.1 U4.15(PA5) ; port SENS_2
SENS_3: C104.2 R74.2 R76.1 U4.16(PA6) ; port SENS_3
SENS_4: C131.2 R91.2 R95.1 U4.17(PA7) ; port SENS_4
START: C18.2 J11.3 R117.1 SW2.3 SW2.4 U4.2(PC13) ; port START
STOP: C19.2 J11.4 R118.1 SW3.3 SW3.4 U4.3(PC14-OSC32_IN) ; port STOP
SWCLC: J7.3 P1.3 U4.37(PA14) ; port SWCLC
SWDIO: J7.2 P1.2 U4.34(PA13) ; port SWDIO
TIME_in_1: R38.1 R39.1 U4.10(PA0) ; port TIME_in_1
TX: J6.4 R5.1 TP10.1(G9) U3.4(VIB) U4.12(PA2) ; port TX
TX_1: J7.4 U4.42(PB6) U?#2.58(PB6) ; port TX_1
NetBT1_2: BT1.2(+) D27.1(C) U4.1(VBAT)
NetC6_1: C6.1(+) C8.1 C10.1 C57.1(+) D27.2(A) L4.1 TP71.1(G9) U4.9(VDDA/VREF+) U4.24(VDD) U4.36(VDD) U4.48(VDD)
NetC13_1: C13.1(+) C15.2 J10.1 R11.1 R12.1 VD1.1(C)
NetC14_1: C14.1(+) C16.2 J14.1 R13.1 R14.1 VD2.1(C)
NetC23_2: C23.2 R15.2 U5.6(DT)
NetC25_2: C25.2 R17.2 U6.6(DT)
NetC33_2: C33.2 R23.1 R24.2
NetC34_1: C34.1(+) C36.2 J18.1 R25.1 R26.1 VD3.1(C)
NetC35_1: C35.1(+) C37.2 J19.1 R27.1 R28.1 VD4.1(C)
NetC39_1: C39.1(+) C42.1 J?.1 L3.2 TP6.1(G9)
NetC51_1: C51.1(+) C53.2 J22.1 R32.1 R33.1 VD5.1(C)
NetC52_1: C52.1(+) C54.2 J23.1 R34.1 R35.1 VD6.1(C)
NetC56_2: C56.2 R36.2 U10.6(DT)
NetC61_2: C61.2 R40.2 U11.6(DT)
NetC69_1: C69.1(+) C73.2 J27.1 R44.1 R45.1 VD7.1(C)
NetC71_2: C71.2 R48.1 R49.2
NetC72_1: C72.1(+) C74.2 J28.1 R46.1 R47.1 VD8.1(C)
NetC81_1: C81.1(+) C83.2 J31.1 R59.1 R60.1 VD9.1(C)
NetC82_1: C82.1(+) C84.2 J32.1 R62.1 R63.1 VD10.1(C)
NetC91_1: C91.1(+) C92.1 L5.1 L9.1 R57.2 TP72.1(G9) U1.2(OUT) U1.4(TAB)
NetC94_2: C94.2 R64.2 U16.6(DT)
NetC96_2: C96.2 R66.2 U17.6(DT)
NetC105_2: C105.2 R74.1 R75.2
NetC106_1: C106.1(+) C108.2 J36.1 R70.1 R71.1 VD11.1(C)
NetC107_1: C107.1(+) C109.2 J37.1 R72.1 R73.1 VD12.1(C)
NetC116_1: C116.1(+) C118.2 J40.1 R79.1 R80.1 VD13.1(C)
NetC117_1: C117.1(+) C119.2 J41.1 R81.1 R82.1 VD14.1(C)
NetC121_2: C121.2 R83.2 U22.6(DT)
NetC125_2: C125.2 R85.2 U23.6(DT)
NetC132_2: C132.2 R91.1 R92.2
NetC133_1: C133.1(+) C135.2 J45.1 R89.1 R90.1 VD15.1(C)
NetC134_1: C134.1(+) C136.2 J46.1 R93.1 R94.1 VD16.1(C)
NetC?#1_1: C?#1.1 U?#2.5(PF0/OSC_IN) Y?.2
NetC?#2_1: C?#2.1 U?#2.6(PF1/OSC_OUT) Y?.1
NetD1_1: D1.1(C) R6.1 U5.15(OUTA)
NetD1_2: D1.2(A) J8.1 R6.2 R11.2
NetD2_1: D2.1(C) R7.1 U6.15(OUTA)
NetD2_2: D2.2(A) J9.1 R7.2 R13.2
NetD3_1: D3.1(C) R19.1 U5.10(OUTB)
NetD3_2: D3.2(A) J16.1 R19.2 R25.2
NetD4_1: D4.1(C) R21.1 U6.10(OUTB)
NetD4_2: D4.2(A) J17.1 R21.2 R27.2
NetD5_1: D5.1(C) R30.1 U10.15(OUTA)
NetD5_2: D5.2(A) J20.1 R30.2 R32.2
NetD6_1: D6.1(C) R31.1 U11.15(OUTA)
NetD6_2: D6.2(A) J21.1 R31.2 R34.2
NetD7_1: D7.1(C) R42.1 U10.10(OUTB)
NetD7_2: D7.2(A) J24.1 R42.2 R44.2
NetD8_1: D8.1(C) R43.1 U11.10(OUTB)
NetD8_2: D8.2(A) J25.1 R43.2 R46.2
NetD9_1: D9.1(C) R51.1 U16.15(OUTA)
NetD9_2: D9.2(A) J29.1 R51.2 R59.2
NetD10_1: D10.1(C) R52.1 U17.15(OUTA)
NetD10_2: D10.2(A) J30.1 R52.2 R62.2
NetD11_1: D11.1(C) R68.1 U16.10(OUTB)
NetD11_2: D11.2(A) J33.1 R68.2 R70.2
NetD12_1: D12.1(C) R69.1 U17.10(OUTB)
NetD12_2: D12.2(A) J35.1 R69.2 R72.2
NetD13_1: D13.1(C) R77.1 U22.15(OUTA)
NetD13_2: D13.2(A) J38.1 R77.2 R79.2
NetD14_1: D14.1(C) R78.1 U23.15(OUTA)
NetD14_2: D14.2(A) J39.1 R78.2 R81.2
NetD15_1: D15.1(C) R87.1 U22.10(OUTB)
NetD15_2: D15.2(A) J43.1 R87.2 R89.2
NetD16_1: D16.1(C) R88.1 U23.10(OUTB)
NetD16_2: D16.2(A) J44.1 R88.2 R93.2
NetD22_1: D22.1(A) R57.1
NetD28_1: D28.1(A) R123.1
NetD29_1: D29.1(A) R113.1
NetD30_1: D30.1(A) R114.1
NetD31_1: D31.1(A) R115.1
NetJ2_1: J2.1 L2.2
NetJ3_2: J3.2 U13.4(+IP)
NetJ5_1: J5.1 R124.2 U18.7(B) ZD19.2(A)
NetJ5_3: J5.3 R3.1 TP11.1(G9) U18.6(A) ZD18.2(A)
NetJ12_1: J12.1 L2.1
NetJ15_1: J15.1 U8.5(-IP)
NetJ26_1: J26.1 U14.5(-IP)
NetJ34_1: J34.1 U20.5(-IP)
NetJ42_1: J42.1 U25.5(-IP)
NetP2_2: P2.2 R20.2
NetP4_2: P4.2 R38.2
NetR2_2: R2.2 U4.44(BOOT0)
NetR8_1: R8.1 R122.1 TP31.1(G9) U18.1(RO)
NetR9_1: R9.1 R119.1 TP7.1(G9) U18.4(DI)
NetR24_1: R24.1 U8.3(OUT)
NetR49_1: R49.1 U14.3(OUT)
NetR54_2: R54.2 TP3.1(G9) U13.3(OUT)
NetR75_1: R75.1 U20.3(OUT)
NetR92_1: R92.1 U25.3(OUT)
NetR119_2: R119.2 U3.13(VOB)
NetR121_1: R121.1 VD18.2(A)
NetR121_2: R121.2 R?#5.1 VD17.1(C)
NetR122_2: R122.2 U3.11(VID)
NetR125_2: R125.2 TP12.1(G9) U3.12(VOC) U18.2(~{RE}) U18.3(DE)
NetR?#1_1: R?#1.1 R?#3.2
NetR?#2_1: R?#2.1 R?#4.2
NetR?#3_1: R?#3.1 R?#5.2
NetR?#4_1: R?#4.1 R?#6.2

Not connected (* = marked no-connect by the designer): R2 1; R10 2; U3 3(VIA) 14(VOA); U5 7(NC) 12(NC) 13(NC); U6 7(NC) 12(NC) 13(NC); U10 7(NC) 12(NC) 13(NC); U11 7(NC) 12(NC) 13(NC); U16 7(NC) 12(NC) 13(NC); U17 7(NC) 12(NC) 13(NC); U22 7(NC) 12(NC) 13(NC); U23 7(NC) 12(NC) 13(NC); U?#1 1(VDD1) 2(VINP) 3(VINN) 5(GND2) 6(VOUTN) 7(VOUTP) 8(VDD2); U?#2 1(VBAT) 2(PC13) 3(PC14/OSC32_IN) 4(PC15/OSC32_OUT) 7(NRST) 8(PC0) 9(PC1) 10(PC2) 11(PC3) 13(VDDA/VREF+) 14(PA0) 15(PA1) 16(PA2) 17(PA3) 19(VDD) 20(PA4) 21(PA5) 22(PA6) 23(PA7) 24(PC4) 25(PC5) 26(PB0) 27(PB1) 28(PB2) 29(PB10) 30(PB11) 32(VDD) 33(PB12) 34(PB13) 35(PB14) 36(PB15) 37(PC6) 38(PC7) 39(PC8) 40(PC9) 43(PA10) 46(PA13) 48(VDD) 51(PC10) 52(PC11) 53(PC12) 54(PD2) 55(PB3) 56(PB4) 57(PB5) 60(BOOT0) 61(PB8) 62(PB9) 64(VDD)

## Layout directives
net class HV: NetC39_1, NetJ2_1, NetJ3_2, NetJ12_1, NetR121_2, V_PS

## Notes on the sheet
- (in symbol ACS758) VCC
- (in symbol CMP-05427-000015-1) +

## Library data of the parts
C1 C2 C45 C57 C58 C90 C91 = 1000uF_10V_Size_F
C3 = CMP-05427-000015-1: CAP ALUM 100UF 20% 50V SMD; Manufacturer: Panasonic; Automotive Grade: Grade 3; Leakage Current: 100uA; Dissipation Factor: 0.12%; Life: 2000Hours; Ripple Current: 200mA; Material: Aluminum; ComponentLink2Description: Datasheet; Category: Cap; Voltage Rating: 50V; Value: 100uF; Octopart: https://octopart.com/eee-1ha101up-panasonic-55396734; Digikey Description: CAP ALUM 100UF 20% 50V SMD; Package: SF; RoHS: TRUE; Height: 10.5mm; ComponentLink2URL: https://industrial.panasonic.com/cdbs/www-data/pdf/RDE0000/ABA0000C1145.pdf; Tolerance: 20%; Mouser Description: Cap Aluminum Lytic 100uF 50V 20% (8 X 10.2mm) SMD 200mA 2000h 85C Automotive T/R; Device Class L2: Capacitors; Temperature Range High: +85°C; Lead Free: Yes; Device Class L3: Aluminum Electrolytic Capacitors; Device Class L1: Passive Components; Manufacturer Part Number: EEE-1HA101UP; Temperature: -40°C to +85°C; Automotive: Yes; Capacitance: 100uF; Voltage: 50V; Temperature Range Low: -40°C
C4 C5 C88 = CAP-POLAR
C6 = 293D106X9050E2TE3: Capacitor Polarised; Manufacturer_Name: Vishay; Datasheet Link: http://www.vishay.com/doc?40002; Height: 4.3mm; Manufacturer_Part_Number: 293D106X9050E2TE3; Mouser Part Number: 74-293D106X9050E2TE3; Mouser Price/Stock: https://www.mouser.com/Search/Refine.aspx?Keyword=74-293D106X9050E2TE3; Arrow Part Number: 293D106X9050E2TE3; Arrow Price/Stock: https://www.arrow.com/en/products/293d106x9050e2te3/vishay
C8 C10 C17-C19 C28 C40 C59 C85 C89 C92 = CMP-1036-04552-2: CAP CER 0.22UF 50V X7R 0805; Manufacturer: KEMET; Value: 0.22 μF; Temperature Coefficient: 30ppm/°C; Material: Ceramic; Tolerance: 0.1; ComponentLink2URL: https://content.kemet.com/datasheets/KEM_C1003_C0G_SMD.pdf; Temperature Characteristic: X7R; Device Class L3: Ceramic Capacitors; Lead Free: Yes; Temperature: -55°C to +125°C; RoHS: TRUE; Capacitance: 0.22 μF; Automotive: No; Octopart: https://octopart.com/c0805c224k5ractu-kemet-144670; Manufacturer Part Number: C0805C224K5RACTU; Temperature Range Low: -55°C; Height: 0.88mm; Device Class L1: Passive Components; Digikey Description: CAP CER 0.22UF 50V X7R 0805; ComponentLink2Description: Datasheet; Mouser Description: CAP CER 0.22UF 50V X7R 0805; Category: Cap; Ipc Land Pattern Name: CAPC200125X78; Temperature Range High: +125°C; Package: C0805C-DN; Device Class L2: Capacitors; Voltage Rating: 50 V
C38 = CAP_POL_LOW_IMP
C42 = CMP-00287-17080245-1: ECQ-E2224JFW ECQE, Met Polyester Film Cap Radial Lead 250VDC, 0.22uF, 5%, L/S =10mm, Blk CRMP; Capacitance: 220nF; Voltage Rating (DC): 250V; Dielectric: PET; NexarPartId: 17080245; Width: 5.5118mm; Length: 11.9888mm; Min Operating Temperature: -40°C; Termination: Radial; Height - Seated (Max): 15.494mm; Max Operating Temperature: 105°C; Lead Pitch: 10mm; Mount: Through Hole; RoHS: Compliant; Dielectric Material: Polyester; Tolerance: 5%; Case/Package: Radial
C43 = CMP-1036-04552-2: CAP CER  2.2UF 50V X7R 0805; Manufacturer: KEMET; Manufacturer Part Number: C0805C224K5RACTU; Value: 0.22 μF; Temperature Coefficient: 30ppm/°C; Material: Ceramic; Tolerance: 0.1; ComponentLink2URL: https://content.kemet.com/datasheets/KEM_C1003_C0G_SMD.pdf; Temperature Characteristic: X7R; Device Class L3: Ceramic Capacitors; Lead Free: Yes; Temperature: -55°C to +125°C; RoHS: TRUE; Capacitance: 0.22 μF; Automotive: No; Octopart: https://octopart.com/c0805c224k5ractu-kemet-144670; Temperature Range Low: -55°C; Height: 0.88mm; Device Class L1: Passive Components; Digikey Description: CAP CER 0.22UF 50V X7R 0805; ComponentLink2Description: Datasheet; Mouser Description: CAP CER 0.22UF 50V X7R 0805; Category: Cap; Ipc Land Pattern Name: CAPC200125X78; Temperature Range High: +125°C; Package: C0805C-DN; Device Class L2: Capacitors; Voltage Rating: 50 V
C44 = CMP-1036-04552-2: CAP CER 2.2UF 50V X7R 0805; Manufacturer: KEMET; Manufacturer Part Number: C0805C224K5RACTU; Value: 0.22 μF; Temperature Coefficient: 30ppm/°C; Material: Ceramic; Tolerance: 0.1; ComponentLink2URL: https://content.kemet.com/datasheets/KEM_C1003_C0G_SMD.pdf; Temperature Characteristic: X7R; Device Class L3: Ceramic Capacitors; Lead Free: Yes; Temperature: -55°C to +125°C; RoHS: TRUE; Capacitance: 0.22 μF; Automotive: No; Octopart: https://octopart.com/c0805c224k5ractu-kemet-144670; Temperature Range Low: -55°C; Height: 0.88mm; Device Class L1: Passive Components; Digikey Description: CAP CER 0.22UF 50V X7R 0805; ComponentLink2Description: Datasheet; Mouser Description: CAP CER 0.22UF 50V X7R 0805; Category: Cap; Ipc Land Pattern Name: CAPC200125X78; Temperature Range High: +125°C; Package: C0805C-DN; Device Class L2: Capacitors; Voltage Rating: 50 V
C86 C87 = CAP-NON-POLAR
C?#1 C?#2 = CMP-2007-03453-2: Chip Multilayer Ceramic Capacitors for General Purpose, 0805, 16pF, X5R, 15%, 10%, 16V; Capacitance: 10uF; Radiation Hardening: No; Thickness: 0.053inch; Voltage Rating (DC): 16V; Lead Free: Lead Free; Package Quantity: 1; Width: 1.25mm; Case Code (Imperial): 0805; Depth: 1.25mm; Packaging: Tape and Reel; Dielectric: X5R; Max Operating Temperature: 85°C; Tolerance: 10%; Voltage Rating: 16V; Voltage: 16V; Height: 1.25mm; Case Code (Metric): 2012; Material: Ceramic; Mount: Surface Mount; Case/Package: 0805; REACH SVHC: No SVHC; Length: 2mm; Min Operating Temperature: -55°C; Termination: SMD/SMT
D22 D28-D31 = 151031YS06000: WURTH ELEKTRONIK - 151031YS06000 - LED, Yellow, Through Hole, T-1 (3mm), 30 mA, 2 V, 590 nm; Geometry.Height: 5.5mm; Manufacturer_Name: Wurth Elektronik; Manufacturer_Part_Number: 151031YS06000; Mouser Part Number: 710-151031YS06000; Mouser Price/Stock: https://www.mouser.co.uk/ProductDetail/Wurth-Elektronik/151031YS06000?qs=LlUlMxKIyB3xSYYW%252BcuBiQ%3D%3D; Arrow Part Number: *; Arrow Price/Stock: *; Mouser Testing Part Number: *; Mouser Testing Price/Stock: *; Datasheet Link: https://katalog.we-online.de/led/datasheet/151031YS06000.pdf
D27 = CMP-249167-000001-1: DIODE GEN PURP 75V 150MA SOD80; Manufacturer: Vishay Small Signal; Max Junction Temp: +175°C; Automotive Grade: Grade 0; Capacitance: 4pF; Peak Reverse Current: 5uA; Forward Current: 300mA; Max Repetitive Reverse Voltage: 100V; Max Surge Forward Current: 2A; Value: 4pF; ComponentLink2Description: Datasheet; Height: 1.6mm; ComponentLink2URL: http://www.vishay.com/docs/85557/ll4148.pdf; Category: Diode; Lead Free: Yes; Device Class L3: Rectifier Diodes; Reverse Voltage: 75V; Mouser Description: Diodes - General Purpose, Power, Switching 100 Volt 100mA; RoHS: TRUE; Temperature: to +175°C; Automotive: Yes; Octopart: https://octopart.com/ll4448-gs08-vishay+small+signal-40886; Digikey Description: DIODE GEN PURP 75V 150MA SOD80; Manufacturer Part Number: LL4448-GS08; Temperature Range High: +175°C; Device Class L1: Discrete Semiconductors; Device Class L2: Diodes; Package: 6.560-5005.01-4
D32 = CMP-02541-000001-1: DIODE ZENER 15V 1.3W DO41; Manufacturer: Vishay; Max Reverse Leakage Current: 0.5uA; Reverse Voltage: 11V; Max Zener Voltage: 15.6V; Zener Impedance: 15Ω; Max Junction Temp: +175°C; Power Dissipation: 1300mW; Automotive Grade: Grade 0; Device Class L3: Zener Diodes; Device Class L1: Discrete Semiconductors; Automotive: Yes; Mouser Description: Zener Diodes 15 Volt 1.3 Watt 5%; Lead Free: Yes; Height: 2.6mm; Octopart: https://octopart.com/bzx85c15-tap-vishay-55401762; Temperature: to +175°C; Digikey Description: DIODE ZENER 15V 1.3W DO41; ComponentLink2URL: http://www.vishay.com/docs/85607/bzx85.pdf; Device Class L2: Diodes; RoHS: TRUE; Temperature Range High: +175°C; ComponentLink2Description: Datasheet; Package: 6.561-5001.02-4; Manufacturer Part Number: BZX85C15-TAP; Category: Diode; Nom Zener Voltage: 15V
D33 = CMP-14400-000025-1: DIODE ZENER 5.1V 300MW SOD323
J1 J2 J4 J13 = 691101710002: WR-TBL Series 101 Horizontal Entry Modular, THT, pitch 5mm, 2p; Manufacturer: Wurth Elektronik; Modularity: Yes; Rated Current: 16A; Working Voltage: 250V; ComponentLink1Description: Website Link; ComponentLink1URL: https://www.we-online.com/redexpert/article/691101710002?ad; ComponentLink2Description: Datasheet Link; ComponentLink2URL: https://www.we-online.com/redexpert/spec/691101710002?ad; Manufacturer Part Number: 691101710002; Category: Terminal Blocks; Match Code: WR-TBL; Mount: Through Hole; Operating Temperature Max: 105°C; Operating Temperature Min: -40°C; Packaging: Box; Application: Pressure Clamp; Number of Pins: 2; Number of Rows: 1; Orientation: Horizontal; Pitch: 5mm
J3 = Connector_Tianli_T-800
J5 = 691101710003: WR-TBL Series 101 Horizontal Entry Modular, Through Hole, pitch 5mm, 3p; Manufacturer: Wurth Elektronik; Pin Number: 3; Rated Current: 16A; Working Voltage: 250V; PCB/Cable/Panel: PCB; Modularity: Yes; ComponentLink1Description: Manufacturer Link; ComponentLink1URL: https://www.we-online.com/redexpert/article/691101710003?ad; ComponentLink2Description: Datasheet; ComponentLink2URL: https://www.we-online.com/redexpert/spec/691101710003?ad; Category: Terminal Blocks; Match Code: WR-TBL; Manufacturer Part Number: 691101710003; Mount: Through Hole; Operating Temperature Max: 105°C; Operating Temperature Min: -40°C; Packaging: Box; Pitch: 5mm; Orientation: Horizontal; Application: Pressure Clamp
J8-J10 J14-J46 J? = Klema_15_A
L1 L4-L9 = CMP-0227-00501-2: NexarPartId: 24533346; Inductance: 270µH; Current Rating: 620mA; Self Resonant Frequency: 4MHz; DC Resistance (DCR): 500mΩ; Ambient Temperature Range Low: -40°C; Min Operating Temperature: -40°C; RoHS: Compliant; Ambient Temperature Range High: 85°C; Packaging: Digi-Reel®; Height: 5.4mm; Length: 9mm; Max Operating Temperature: 125°C; Width: 10mm
P1 = CMP-1024-00357-1: 0.025" SQ Post Header, Through-hole, Vertical, -55 to 125 degC, 2.54 mm Pitch, 4-Pin, Male, RoHS; Manufacturer: Samtec; Pitch: 2.54 mm; RoHS: True; ComponentLink3URL: http://www.samtec.com/documents/webfiles/cpdf/TSW-XXX-XX-XXX-X-XX-XXX-MKT.pdf; Mounting Technology: Through-hole; ComponentLink2URL: http://www.samtec.com/documents/webfiles/pdf/TSW_TH.PDF; ComponentLink1URL: http://www.samtec.com; ComponentLink3Description: Package Specification; PackageVersion: DM, 8/1988; ComponentLink2Description: Datasheet; PackageReference: TSW-104-08-X-S; PackageDescription: .025[0.64] SQ. Post Terminal Strip Assembly; PartNumber: TSW-104-08-G-S; ComponentLink1Description: Manufacturer URL; Temperature Range: -55 to 125 degC; DatasheetVersion: F-214; Orientation: Vertical
P2 P4 = 61900311121: WR-WTB THT Male Vertical Locking Header, pitch 2.54mm, 3p; Pin Number: 3; Contact Resistance: 20mOhm; Rated Current: 3A; Withstanding Voltage: 1000VAC; Working Voltage: 250VAC; ComponentLink1Description: Manufacturer; ComponentLink1URL: http://www.we-online.de; ComponentLink2Description: Datasheet; ComponentLink2URL: https://www.we-online.com/catalog/datasheet/61900311121.pdf; Pitch: 2.54mm; Published Date: January 2020; Publisher: Wurth Elektronik; Mounting Technology: THT; Packaging: Bag; Operating Temperature: -40 to +105degC; Part Number: 61900311121; Gender: Male; Type: Vertical
P12-P14 = 61300511121: WR-PHD Pin Header, THT, Vertical, pitch 2.54mm, 1 Row, 5P; Manufacturer: Wurth Elektronik; Contact Resistance: 20mΩ; Rated Current: 3A; Working Voltage: 250V; Withstanding Voltage: 500V; ComponentLink1Description: Website Link; ComponentLink1URL: https://www.we-online.com/redexpert/article/61300511121?ad; ComponentLink2Description: Datasheet Link; ComponentLink2URL: https://www.we-online.com/redexpert/spec/61300511121?ad; Manufacturer Part Number: 61300511121; Category: Board-to-Board Connectors; Match Code: WR-PHD; Mount: Through Hole; Operating Temperature Max: 105°C; Operating Temperature Min: -40°C; Packaging: Bag; Gender: Pin Header; Number of Pins: 5; Number of Rows: 1; Orientation: Vertical; Pitch: 2.54mm
R6 R7 R11-R19 R21 R23-R37 R40-R52 R59 R60 R62-R95 = RES-CONST
R8 R9 R57 R58 R61 R113-R115 R119 R122-R125 = RC0805FR-07100KL
R121 = RC0805FR-07100KL: 220
RG1 = Reg_Fairchild_LM7805CT_eec: REG IC REG LINEAR 5V 1A TO220AB; Voltage Dropout (Max): 2V @ 1A (Typ); Voltage - Input (Max): 35V; helpURL: https://upverter.com/upn/revision/b27a7358b7dd93a3/; ComponentLink2Description: Datasheet; Temperature: -40°C to +125°C; Package: TO220; Supplier 2: Mouser; Price: 0.384521982769; Supplier 1: Digi-Key; ComponentLink1URL: https://upverter.com/upn/revision/b27a7358b7dd93a3/; Supplier Part Number 2: 512-LM7805CT; Supplier Part Number 1: LM7805CT-ND; Manufacturer: Fairchild; ComponentLink1Description: Upverter; ComponentLink2URL: https://www.fairchildsemi.com/datasheets/LM/LM7805.pdf; RoHS: TRUE; Mouser Part Number: 512-LM7805CT; Ipc Land Pattern Name: TO-220; Temperature Range High: +125°C; Digikey Description: REG IC REG LINEAR 5V 1A TO220AB; Digikey Part Number: LM7805CT-ND; Lead Free: yes; Temperature Range Low: -40°C; Voltage - Output: 5V; Current-Output: 1A
SW1-SW3 = 4-1437565-2: No Description Available; Mfr_Name: TE Connectivity; Copyright: Copyright (C) 2022 Ultra Librarian. All rights reserved.; Manufacturer_Part_Number: 4-1437565-2; RefDes: RefDes; Type: DEV
TP1-TP7 TP9-TP12 TP31 TP32 TP55 TP56 TP71-TP73 TP86-TP90 = TP_PCB?: Test_Point
U1 = CMP-0062-01639-4: 800mA Low-Dropout Linear Regulator, 4-pin SOT-223, Pb-Free; Manufacturer: Texas Instruments; High-Reliability: Y; PowerWise: N; PackageTopMarking: XYTT*N05A; CompType: LDO IC; ComponentLink1URL: http://www.ti.com/general/docs/lit/getliterature.tsp?genericPartNumber=LM1117-N&fileType=pdf; PartNumber: LM1117MPX-3.3/NOPB; ComponentLink1Description: Datasheet URL; PinCount: 4; Code_JEDEC: TO-261-AA; PackageDescription: Molded SOT-223, 6.50 x 3.56 x 1.6mm Body, 4 Lead, 2.3mm Pitch; PackageReference: DCY0004A; RoHS: Y; Code_IPC: SOT223-4
U2 = B0505s-1W: DC DC Converter 5V 1W
U3 = CMP-0534-00565-1: Quad Channel Digital Isolator, 2.5 KV rms Insulation Rating, 10 Mbps Data Rate, 50 ns Delay, Industrial, 16-pin SOIC (RW-16), Tube; Manufacturer: Analog Devices; Max Data Rate: 10Mbps; ComponentLink2URL: http://www.analog.com/static/imported-files/data_sheets/ADuM1400_1401_1402.pdf; ComponentLink5Description: URL Link2; ComponentLink3URL: http://www.analog.com/static/imported-files/packages/PKG_PDF/SOIC_WIDE%20%28RW%29/RW_16.pdf; DatasheetVersion: Rev. H; ComponentLink2Description: Datasheet; ComponentLink3Description: Package Specification; PartNumber: ADUM1401BRWZ; ComponentLink5URL: Reference Circuit:http://www.analog.com/en/interface-isolation/digital-isolators/adum1401/products/product.html#product-recommendations; Max Operating Temp (degreesC): 125; PackageReference: RW-16; PackageVersion: 032707-B, 03/2007; ComponentLink1Description: Manufacturer URL; Code_JEDEC: MS-013-AA; PackageDescription: 16-Pin Standard Small Outline Package, Body 10.3 x 7.5 mm, Pitch 1.27 mm; Mounting Technology: Surface Mount; ComponentLink1URL: http://www.analog.com/en/index.html; ComponentLink4Description: URL Link1; ComponentLink4URL: Product URL:http://www.analog.com/en/interface-isolation/digital-isolators/adum1401/products/product.html
U4 = STM32F303CCT6: No Description Available; Mfr_Name: STMicroelectronics; RefDes: RefDes; Type: Type
U13 = ACS758
VD1-VD17 = ZENER
Y? = CMP-1749-00004-1: Resistance Weld Thru-Hole Crystal, 12 MHz, +/-30 ppm, -20 to 70 degC, 2-Pin THD, RoHS, Bulk; Elements: 1; Rds On Max: 115 mohm; Typical Rise Time: 90 ns; Max Power Dissipation: 2.5 W; Case\Package: TO-251-3; Input Capacitance: 350 pF; REACH SVHC: No SVHC; Length: 6.6 mm; ComponentLink1URL: http://www.foxonline.com/; PackageDescription: 2-Pin Through Hole Device, Body 11.35 x 4.65 mm, Pitch 4.88 mm; Radiation Hardening: No; Package Quantity: 70; Packaging: Rail/Tube; ComponentLink1Description: Manufacturer URL; Min Operating Temperature: -55 degC; Max Operating Temperature: 150 degC; RoHSCompliant: true; PackageReference: FOXSLF-2; DatasheetVersion: Mar-15; Pins: 3; Height: 6.1 mm; Mount: Through Hole; ComponentLink2URL: http://www.foxonline.com/pdfs/hc49slf.pdf; ComponentLink2Description: Datasheet; Width: 2.3 mm